# Altium project motordriver-v5.1.PrjPcb (part 1 of 3)
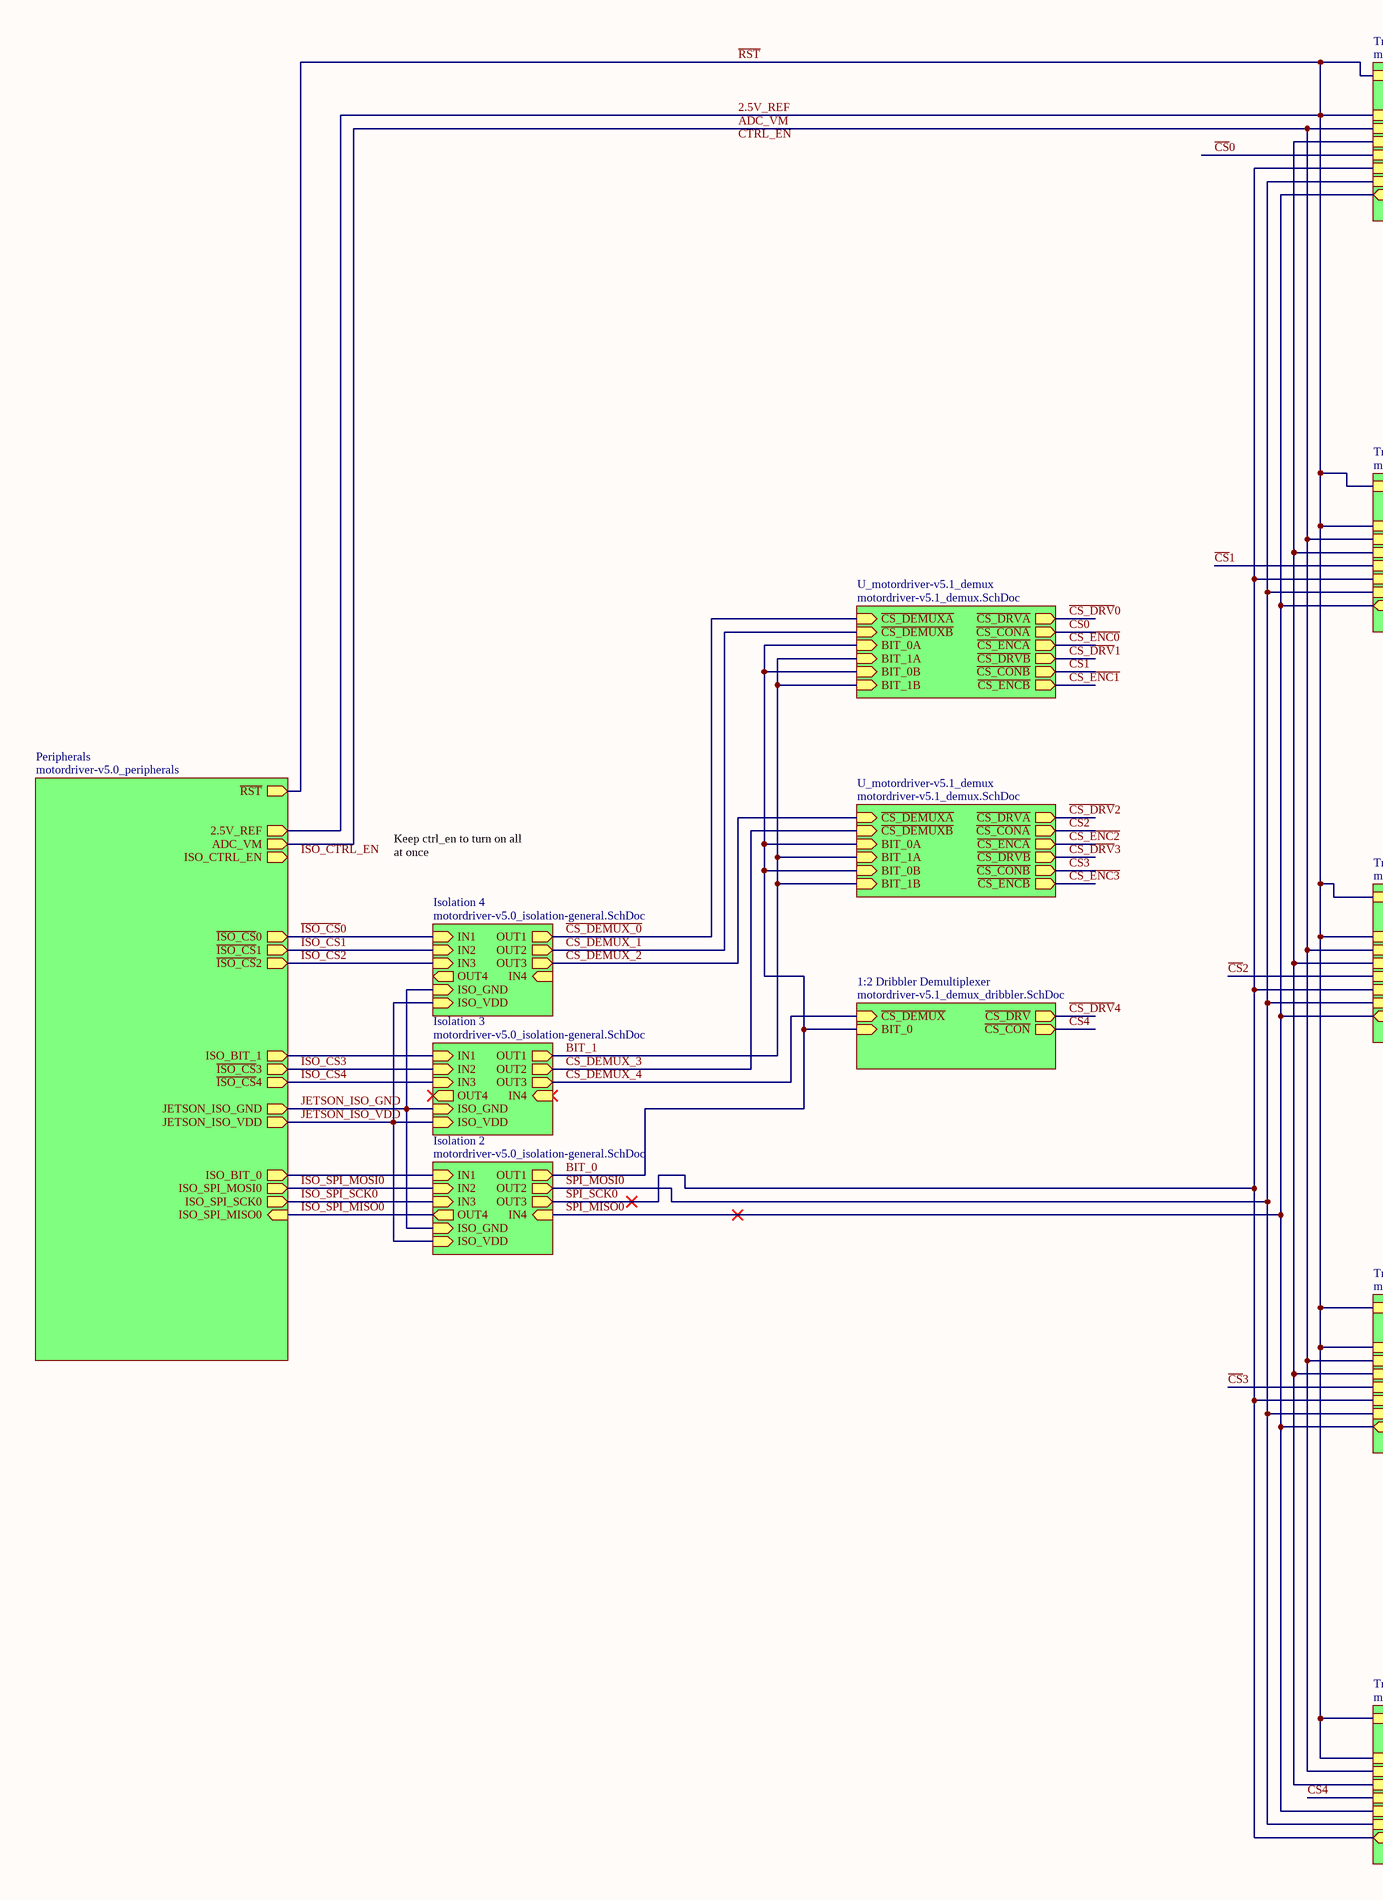
[diagram p0: motordriver-v5.0_top-level.SchDoc, left]
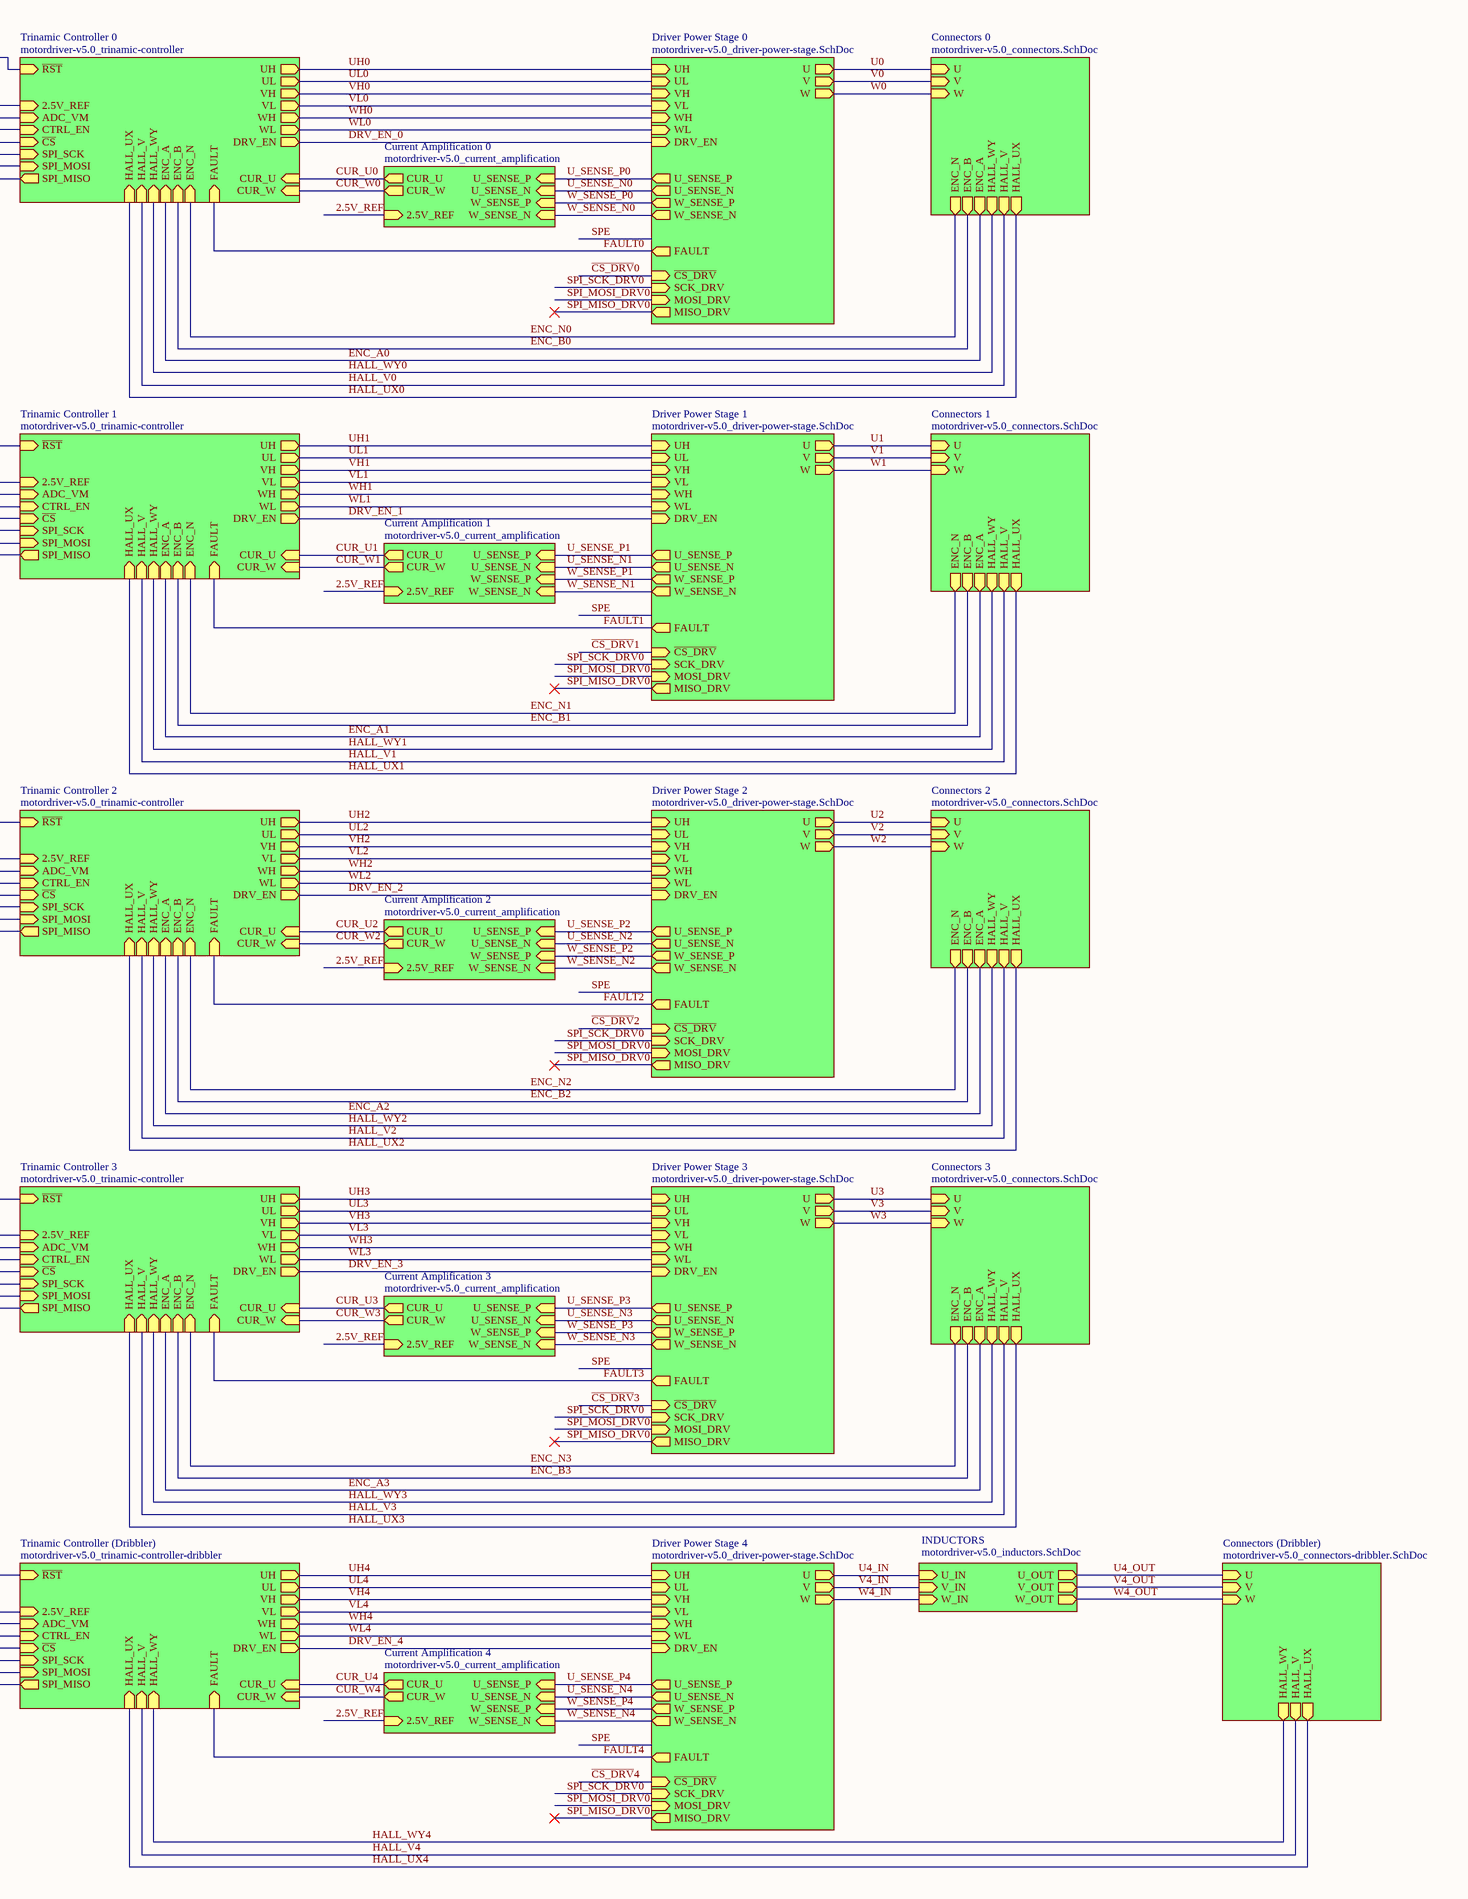
[diagram p1: motordriver-v5.0_top-level.SchDoc, right]
13 sheets, 758 parts. Net scope: hierarchical (ports join the sheet entries above them; power ports are global).
Board file: motordriver-v5.0.PcbDoc
Sheets:
  motordriver-v5.0_top-level.SchDoc
    Peripherals = motordriver-v5.0_peripherals.SchDoc
    INDUCTORS = motordriver-v5.0_inductors.SchDoc
    Trinamic Controller (Dribbler) = motordriver-v5.0_trinamic-controller-dribbler.SchDoc
    Connectors (Dribbler) = motordriver-v5.0_connectors-dribbler.SchDoc
    Driver Power Stage 0 = motordriver-v5.0_driver-power-stage.SchDoc
    Trinamic Controller 0 = motordriver-v5.0_trinamic-controller.SchDoc
    Connectors 0 = motordriver-v5.0_connectors.SchDoc
    Isolation 2 = motordriver-v5.0_isolation-general.SchDoc
    Current Amplification 0 = motordriver-v5.0_current_amplification.SchDoc
    Driver Power Stage 1 = motordriver-v5.0_driver-power-stage.SchDoc
    Trinamic Controller 1 = motordriver-v5.0_trinamic-controller.SchDoc
    Connectors 1 = motordriver-v5.0_connectors.SchDoc
    Current Amplification 1 = motordriver-v5.0_current_amplification.SchDoc
    Driver Power Stage 2 = motordriver-v5.0_driver-power-stage.SchDoc
    Trinamic Controller 2 = motordriver-v5.0_trinamic-controller.SchDoc
    Connectors 2 = motordriver-v5.0_connectors.SchDoc
    Current Amplification 2 = motordriver-v5.0_current_amplification.SchDoc
    Driver Power Stage 3 = motordriver-v5.0_driver-power-stage.SchDoc
    Trinamic Controller 3 = motordriver-v5.0_trinamic-controller.SchDoc
    Connectors 3 = motordriver-v5.0_connectors.SchDoc
    Current Amplification 3 = motordriver-v5.0_current_amplification.SchDoc
    Driver Power Stage 4 = motordriver-v5.0_driver-power-stage.SchDoc
    Current Amplification 4 = motordriver-v5.0_current_amplification.SchDoc
    1:2 Dribbler Demultiplexer = motordriver-v5.1_demux_dribbler.SchDoc
    U_motordriver-v5.1_demux = motordriver-v5.1_demux.SchDoc
    U_motordriver-v5.1_demux = motordriver-v5.1_demux.SchDoc
    Isolation 3 = motordriver-v5.0_isolation-general.SchDoc
    Isolation 4 = motordriver-v5.0_isolation-general.SchDoc
  top-level-simplified.SchDoc
    Peripherals = motordriver-v5.0_peripherals.SchDoc
    Driver Power Stage = motordriver-v5.0_driver-power-stage.SchDoc
    Trinamic Controller = motordriver-v5.0_trinamic-controller.SchDoc
    Connectors = motordriver-v5.0_connectors.SchDoc
    Current Amplification = motordriver-v5.0_current_amplification.SchDoc
    Isolation = motordriver-v5.0_isolation-general.SchDoc
    INDUCTORS = motordriver-v5.0_inductors.SchDoc

## Sheet motordriver-v5.0_top-level.SchDoc
size 863 x 558 mm; SheetNumber: 1; SheetTotal: 12

### Sub-sheets
1:2 Dribbler Demultiplexer = motordriver-v5.1_demux_dribbler.SchDoc: ~{CS_DRV} (out), ~{CS_CON} (out), ~{CS_DEMUX} (in), BIT_0 (in)
Connectors 0 = motordriver-v5.0_connectors.SchDoc: U (in), V (in), W (in), HALL_UX (out), HALL_V (out), HALL_WY (out), ENC_A (out), ENC_B (out), ENC_N (out)
Connectors 1 = motordriver-v5.0_connectors.SchDoc: U (in), V (in), W (in), HALL_UX (out), HALL_V (out), HALL_WY (out), ENC_A (out), ENC_B (out), ENC_N (out)
Connectors 2 = motordriver-v5.0_connectors.SchDoc: U (in), V (in), W (in), HALL_UX (out), HALL_V (out), HALL_WY (out), ENC_A (out), ENC_B (out), ENC_N (out)
Connectors 3 = motordriver-v5.0_connectors.SchDoc: U (in), V (in), W (in), HALL_UX (out), HALL_V (out), HALL_WY (out), ENC_A (out), ENC_B (out), ENC_N (out)
Connectors (Dribbler) = motordriver-v5.0_connectors-dribbler.SchDoc: U (in), V (in), W (in), HALL_UX (out), HALL_V (out), HALL_WY (out)
Current Amplification 0 = motordriver-v5.0_current_amplification: CUR_U (out), CUR_W (out), U_SENSE_P (in), U_SENSE_N (in), W_SENSE_N (in), W_SENSE_P (in), 2.5V_REF (in)
Current Amplification 1 = motordriver-v5.0_current_amplification: CUR_U (out), CUR_W (out), U_SENSE_P (in), U_SENSE_N (in), W_SENSE_N (in), W_SENSE_P (in), 2.5V_REF (in)
Current Amplification 2 = motordriver-v5.0_current_amplification: CUR_U (out), CUR_W (out), U_SENSE_P (in), U_SENSE_N (in), W_SENSE_N (in), W_SENSE_P (in), 2.5V_REF (in)
Current Amplification 3 = motordriver-v5.0_current_amplification: CUR_U (out), CUR_W (out), U_SENSE_P (in), U_SENSE_N (in), W_SENSE_N (in), W_SENSE_P (in), 2.5V_REF (in)
Current Amplification 4 = motordriver-v5.0_current_amplification: CUR_U (out), CUR_W (out), U_SENSE_P (in), U_SENSE_N (in), W_SENSE_N (in), W_SENSE_P (in), 2.5V_REF (in)
Driver Power Stage 0 = motordriver-v5.0_driver-power-stage.SchDoc: U (out), V (out), W (out), U_SENSE_P (out), U_SENSE_N (out), DRV_EN (in), UH (in), UL (in), VH (in), VL (in), WH (in), WL (in), FAULT (out), ~{CS_DRV} (in), MISO_DRV (out), MOSI_DRV (in), SCK_DRV (in), W_SENSE_P (out), W_SENSE_N (out)
Driver Power Stage 1 = motordriver-v5.0_driver-power-stage.SchDoc: U (out), V (out), W (out), U_SENSE_P (out), U_SENSE_N (out), DRV_EN (in), UH (in), UL (in), VH (in), VL (in), WH (in), WL (in), FAULT (out), ~{CS_DRV} (in), MISO_DRV (out), MOSI_DRV (in), SCK_DRV (in), W_SENSE_P (out), W_SENSE_N (out)
Driver Power Stage 2 = motordriver-v5.0_driver-power-stage.SchDoc: U (out), V (out), W (out), U_SENSE_P (out), U_SENSE_N (out), DRV_EN (in), UH (in), UL (in), VH (in), VL (in), WH (in), WL (in), FAULT (out), ~{CS_DRV} (in), MISO_DRV (out), MOSI_DRV (in), SCK_DRV (in), W_SENSE_P (out), W_SENSE_N (out)
Driver Power Stage 3 = motordriver-v5.0_driver-power-stage.SchDoc: U (out), V (out), W (out), U_SENSE_P (out), U_SENSE_N (out), DRV_EN (in), UH (in), UL (in), VH (in), VL (in), WH (in), WL (in), FAULT (out), ~{CS_DRV} (in), MISO_DRV (out), MOSI_DRV (in), SCK_DRV (in), W_SENSE_P (out), W_SENSE_N (out)
Driver Power Stage 4 = motordriver-v5.0_driver-power-stage.SchDoc: U (out), V (out), W (out), U_SENSE_P (out), U_SENSE_N (out), DRV_EN (in), UH (in), UL (in), VH (in), VL (in), WH (in), WL (in), FAULT (out), ~{CS_DRV} (in), MISO_DRV (out), MOSI_DRV (in), SCK_DRV (in), W_SENSE_P (out), W_SENSE_N (out)
INDUCTORS = motordriver-v5.0_inductors.SchDoc: U_IN (in), V_IN (in), W_IN (in), V_OUT (out), W_OUT (out), U_OUT (out)
Isolation 2 = motordriver-v5.0_isolation-general.SchDoc: OUT1 (out), IN1 (in), IN2 (in), IN3 (in), OUT4 (out), IN4 (in), OUT3 (out), OUT2 (out), ISO_GND (in), ISO_VDD (in)
Isolation 3 = motordriver-v5.0_isolation-general.SchDoc: OUT1 (out), IN1 (in), IN2 (in), IN3 (in), OUT4 (out), IN4 (in), OUT3 (out), OUT2 (out), ISO_GND (in), ISO_VDD (in)
Isolation 4 = motordriver-v5.0_isolation-general.SchDoc: OUT1 (out), IN1 (in), IN2 (in), IN3 (in), OUT4 (out), IN4 (in), OUT3 (out), OUT2 (out), ISO_GND (in), ISO_VDD (in)
Peripherals = motordriver-v5.0_peripherals: ~{RST} (out), ADC_VM (out), ISO_CTRL_EN (out), ISO_SPI_MISO0 (in), JETSON_ISO_VDD (out), JETSON_ISO_GND (out), ~{ISO_CS}1 (out), ~{ISO_CS}2 (out), ~{ISO_CS}4 (out), 2.5V_REF (out), ~{ISO_CS}0 (out), ISO_BIT_1 (out), ~{ISO_CS}3 (out), ISO_SPI_MOSI0 (out), ISO_SPI_SCK0 (out), ISO_BIT_0 (out)
Trinamic Controller 0 = motordriver-v5.0_trinamic-controller: ~{RST} (in), CUR_U (in), CUR_W (in), DRV_EN (out), ADC_VM (in), CTRL_EN (in), UH (out), UL (out), VH (out), VL (out), WH (out), WL (out), HALL_UX (in), HALL_V (in), HALL_WY (in), ENC_A (in), ENC_B (in), ENC_N (in), ~{CS} (in), SPI_MISO (out), SPI_MOSI (in), SPI_SCK (in), 2.5V_REF (in), FAULT (in)
Trinamic Controller 1 = motordriver-v5.0_trinamic-controller: ~{RST} (in), CUR_U (in), CUR_W (in), DRV_EN (out), ADC_VM (in), CTRL_EN (in), UH (out), UL (out), VH (out), VL (out), WH (out), WL (out), HALL_UX (in), HALL_V (in), HALL_WY (in), ENC_A (in), ENC_B (in), ENC_N (in), ~{CS} (in), SPI_MISO (out), SPI_MOSI (in), SPI_SCK (in), 2.5V_REF (in), FAULT (in)
Trinamic Controller 2 = motordriver-v5.0_trinamic-controller: ~{RST} (in), CUR_U (in), CUR_W (in), DRV_EN (out), ADC_VM (in), CTRL_EN (in), UH (out), UL (out), VH (out), VL (out), WH (out), WL (out), HALL_UX (in), HALL_V (in), HALL_WY (in), ENC_A (in), ENC_B (in), ENC_N (in), ~{CS} (in), SPI_MISO (out), SPI_MOSI (in), SPI_SCK (in), 2.5V_REF (in), FAULT (in)
Trinamic Controller 3 = motordriver-v5.0_trinamic-controller: ~{RST} (in), CUR_U (in), CUR_W (in), DRV_EN (out), ADC_VM (in), CTRL_EN (in), UH (out), UL (out), VH (out), VL (out), WH (out), WL (out), HALL_UX (in), HALL_V (in), HALL_WY (in), ENC_A (in), ENC_B (in), ENC_N (in), ~{CS} (in), SPI_MISO (out), SPI_MOSI (in), SPI_SCK (in), 2.5V_REF (in), FAULT (in)
Trinamic Controller (Dribbler) = motordriver-v5.0_trinamic-controller-dribbler: ~{RST} (in), CUR_U (in), CUR_W (in), DRV_EN (out), UH (out), UL (out), VH (out), VL (out), WH (out), WL (out), HALL_UX (in), HALL_V (in), HALL_WY (in), ADC_VM (in), CTRL_EN (in), ~{CS} (in), SPI_MISO (out), SPI_MOSI (in), SPI_SCK (in), 2.5V_REF (in), FAULT (in)
U_motordriver-v5.1_demux = motordriver-v5.1_demux.SchDoc: ~{CS_DEMUXA} (in), ~{CS_DRVA} (out), ~{CS_CONA} (out), ~{CS_ENCA} (out), ~{CS_DEMUXB} (in), ~{CS_DRVB} (out), ~{CS_CONB} (out), ~{CS_ENCB} (out), BIT_0A (in), BIT_1A (in), BIT_0B (in), BIT_1B (in)
U_motordriver-v5.1_demux = motordriver-v5.1_demux.SchDoc: ~{CS_DEMUXA} (in), ~{CS_DRVA} (out), ~{CS_CONA} (out), ~{CS_ENCA} (out), ~{CS_DEMUXB} (in), ~{CS_DRVB} (out), ~{CS_CONB} (out), ~{CS_ENCB} (out), BIT_0A (in), BIT_1A (in), BIT_0B (in), BIT_1B (in)

### Nets
2.5V_REF: sheet Peripherals/~{RST}, sheet Peripherals/2.5V_REF, sheet Trinamic Controller (Dribbler)/~{RST}, sheet Trinamic Controller (Dribbler)/2.5V_REF, sheet Trinamic Controller 0/~{RST}, sheet Trinamic Controller 0/2.5V_REF, sheet Current Amplification 0/2.5V_REF, sheet Trinamic Controller 1/~{RST}, sheet Trinamic Controller 1/2.5V_REF, sheet Current Amplification 1/2.5V_REF, sheet Trinamic Controller 2/~{RST}, sheet Trinamic Controller 2/2.5V_REF, sheet Current Amplification 2/2.5V_REF, sheet Trinamic Controller 3/~{RST}, sheet Trinamic Controller 3/2.5V_REF, sheet Current Amplification 3/2.5V_REF, sheet Current Amplification 4/2.5V_REF  [also labelled ~{RST}]
ADC_VM: sheet Peripherals/ADC_VM, sheet Trinamic Controller (Dribbler)/ADC_VM, sheet Trinamic Controller 0/ADC_VM, sheet Trinamic Controller 1/ADC_VM, sheet Trinamic Controller 2/ADC_VM, sheet Trinamic Controller 3/ADC_VM
BIT_0: sheet Isolation 2/OUT1, sheet 1:2 Dribbler Demultiplexer/BIT_0, sheet U_motordriver-v5.1_demux/BIT_0A, sheet U_motordriver-v5.1_demux/BIT_0B, sheet U_motordriver-v5.1_demux/BIT_0A, sheet U_motordriver-v5.1_demux/BIT_0B
BIT_1: sheet U_motordriver-v5.1_demux/BIT_1A, sheet U_motordriver-v5.1_demux/BIT_1B, sheet U_motordriver-v5.1_demux/BIT_1A, sheet U_motordriver-v5.1_demux/BIT_1B, sheet Isolation 3/OUT1
~{CS}0: sheet Trinamic Controller 0/~{CS}, sheet U_motordriver-v5.1_demux/~{CS_CONA}
~{CS}1: sheet Trinamic Controller 1/~{CS}, sheet U_motordriver-v5.1_demux/~{CS_CONB}
~{CS}2: sheet Trinamic Controller 2/~{CS}, sheet U_motordriver-v5.1_demux/~{CS_CONA}
~{CS}3: sheet Trinamic Controller 3/~{CS}, sheet U_motordriver-v5.1_demux/~{CS_CONB}
~{CS}4: sheet Trinamic Controller (Dribbler)/~{CS}, sheet 1:2 Dribbler Demultiplexer/~{CS_CON}
~{CS_DEMUX_0}: sheet U_motordriver-v5.1_demux/~{CS_DEMUXA}, sheet Isolation 4/OUT1
~{CS_DEMUX_1}: sheet U_motordriver-v5.1_demux/~{CS_DEMUXB}, sheet Isolation 4/OUT2
~{CS_DEMUX_2}: sheet U_motordriver-v5.1_demux/~{CS_DEMUXA}, sheet Isolation 4/OUT3
~{CS_DEMUX_3}: sheet U_motordriver-v5.1_demux/~{CS_DEMUXB}, sheet Isolation 3/OUT2
~{CS_DEMUX_4}: sheet 1:2 Dribbler Demultiplexer/~{CS_DEMUX}, sheet Isolation 3/OUT3
~{CS_DRV}0: sheet Driver Power Stage 0/~{CS_DRV}, sheet U_motordriver-v5.1_demux/~{CS_DRVA}
~{CS_DRV}1: sheet Driver Power Stage 1/~{CS_DRV}, sheet U_motordriver-v5.1_demux/~{CS_DRVB}
~{CS_DRV}2: sheet Driver Power Stage 2/~{CS_DRV}, sheet U_motordriver-v5.1_demux/~{CS_DRVA}
~{CS_DRV}3: sheet Driver Power Stage 3/~{CS_DRV}, sheet U_motordriver-v5.1_demux/~{CS_DRVB}
~{CS_DRV}4: sheet Driver Power Stage 4/~{CS_DRV}, sheet 1:2 Dribbler Demultiplexer/~{CS_DRV}
CTRL_EN: sheet Trinamic Controller (Dribbler)/CTRL_EN, sheet Trinamic Controller 0/CTRL_EN, sheet Trinamic Controller 1/CTRL_EN, sheet Trinamic Controller 2/CTRL_EN, sheet Trinamic Controller 3/CTRL_EN
CUR_U0: sheet Trinamic Controller 0/CUR_U, sheet Current Amplification 0/CUR_U
CUR_U1: sheet Trinamic Controller 1/CUR_U, sheet Current Amplification 1/CUR_U
CUR_U2: sheet Trinamic Controller 2/CUR_U, sheet Current Amplification 2/CUR_U
CUR_U3: sheet Trinamic Controller 3/CUR_U, sheet Current Amplification 3/CUR_U
CUR_U4: sheet Trinamic Controller (Dribbler)/CUR_U, sheet Current Amplification 4/CUR_U
CUR_W0: sheet Trinamic Controller 0/CUR_W, sheet Current Amplification 0/CUR_W
CUR_W1: sheet Trinamic Controller 1/CUR_W, sheet Current Amplification 1/CUR_W
CUR_W2: sheet Trinamic Controller 2/CUR_W, sheet Current Amplification 2/CUR_W
CUR_W3: sheet Trinamic Controller 3/CUR_W, sheet Current Amplification 3/CUR_W
CUR_W4: sheet Trinamic Controller (Dribbler)/CUR_W, sheet Current Amplification 4/CUR_W
DRV_EN_0: sheet Driver Power Stage 0/DRV_EN, sheet Trinamic Controller 0/DRV_EN
DRV_EN_1: sheet Driver Power Stage 1/DRV_EN, sheet Trinamic Controller 1/DRV_EN
DRV_EN_2: sheet Driver Power Stage 2/DRV_EN, sheet Trinamic Controller 2/DRV_EN
DRV_EN_3: sheet Driver Power Stage 3/DRV_EN, sheet Trinamic Controller 3/DRV_EN
DRV_EN_4: sheet Trinamic Controller (Dribbler)/DRV_EN, sheet Driver Power Stage 4/DRV_EN
ENC_A0: sheet Trinamic Controller 0/ENC_A, sheet Connectors 0/ENC_A
ENC_A1: sheet Trinamic Controller 1/ENC_A, sheet Connectors 1/ENC_A
ENC_A2: sheet Trinamic Controller 2/ENC_A, sheet Connectors 2/ENC_A
ENC_A3: sheet Trinamic Controller 3/ENC_A, sheet Connectors 3/ENC_A
ENC_B0: sheet Trinamic Controller 0/ENC_B, sheet Connectors 0/ENC_B
ENC_B1: sheet Trinamic Controller 1/ENC_B, sheet Connectors 1/ENC_B
ENC_B2: sheet Trinamic Controller 2/ENC_B, sheet Connectors 2/ENC_B
ENC_B3: sheet Trinamic Controller 3/ENC_B, sheet Connectors 3/ENC_B
ENC_N0: sheet Trinamic Controller 0/ENC_N, sheet Connectors 0/ENC_N
ENC_N1: sheet Trinamic Controller 1/ENC_N, sheet Connectors 1/ENC_N
ENC_N2: sheet Trinamic Controller 2/ENC_N, sheet Connectors 2/ENC_N
ENC_N3: sheet Trinamic Controller 3/ENC_N, sheet Connectors 3/ENC_N
FAULT0: sheet Driver Power Stage 0/FAULT, sheet Trinamic Controller 0/FAULT
FAULT1: sheet Driver Power Stage 1/FAULT, sheet Trinamic Controller 1/FAULT
FAULT2: sheet Driver Power Stage 2/FAULT, sheet Trinamic Controller 2/FAULT
FAULT3: sheet Driver Power Stage 3/FAULT, sheet Trinamic Controller 3/FAULT
FAULT4: sheet Trinamic Controller (Dribbler)/FAULT, sheet Driver Power Stage 4/FAULT
HALL_UX0: sheet Trinamic Controller 0/HALL_UX, sheet Connectors 0/HALL_UX
HALL_UX1: sheet Trinamic Controller 1/HALL_UX, sheet Connectors 1/HALL_UX
HALL_UX2: sheet Trinamic Controller 2/HALL_UX, sheet Connectors 2/HALL_UX
HALL_UX3: sheet Trinamic Controller 3/HALL_UX, sheet Connectors 3/HALL_UX
HALL_UX4: sheet Trinamic Controller (Dribbler)/HALL_UX, sheet Connectors (Dribbler)/HALL_UX
HALL_V0: sheet Trinamic Controller 0/HALL_V, sheet Connectors 0/HALL_V
HALL_V1: sheet Trinamic Controller 1/HALL_V, sheet Connectors 1/HALL_V
HALL_V2: sheet Trinamic Controller 2/HALL_V, sheet Connectors 2/HALL_V
HALL_V3: sheet Trinamic Controller 3/HALL_V, sheet Connectors 3/HALL_V
HALL_V4: sheet Trinamic Controller (Dribbler)/HALL_V, sheet Connectors (Dribbler)/HALL_V
HALL_WY0: sheet Trinamic Controller 0/HALL_WY, sheet Connectors 0/HALL_WY
HALL_WY1: sheet Trinamic Controller 1/HALL_WY, sheet Connectors 1/HALL_WY
HALL_WY2: sheet Trinamic Controller 2/HALL_WY, sheet Connectors 2/HALL_WY
HALL_WY3: sheet Trinamic Controller 3/HALL_WY, sheet Connectors 3/HALL_WY
HALL_WY4: sheet Trinamic Controller (Dribbler)/HALL_WY, sheet Connectors (Dribbler)/HALL_WY
~{ISO_CS}0: sheet Peripherals/~{ISO_CS}0, sheet Isolation 4/IN1
~{ISO_CS}1: sheet Peripherals/~{ISO_CS}1, sheet Isolation 4/IN2
~{ISO_CS}2: sheet Peripherals/~{ISO_CS}2, sheet Isolation 4/IN3
~{ISO_CS}3: sheet Peripherals/~{ISO_CS}3, sheet Isolation 3/IN2
~{ISO_CS}4: sheet Peripherals/~{ISO_CS}4, sheet Isolation 3/IN3
IN1: sheet Peripherals/ISO_BIT_0, sheet Isolation 2/IN1
IN1: sheet Peripherals/ISO_BIT_1, sheet Isolation 3/IN1  [a separate net that carries the same name]
ISO_SPI_MISO0: sheet Peripherals/ISO_SPI_MISO0, sheet Isolation 2/OUT4
ISO_SPI_MOSI0: sheet Peripherals/ISO_SPI_MOSI0, sheet Isolation 2/IN2
ISO_SPI_SCK0: sheet Peripherals/ISO_SPI_SCK0, sheet Isolation 2/IN3
JETSON_ISO_GND: sheet Peripherals/JETSON_ISO_GND, sheet Isolation 2/ISO_GND, sheet Isolation 3/ISO_GND, sheet Isolation 4/ISO_GND
JETSON_ISO_VDD: sheet Peripherals/JETSON_ISO_VDD, sheet Isolation 2/ISO_VDD, sheet Isolation 3/ISO_VDD, sheet Isolation 4/ISO_VDD
SPI_MISO0: sheet Trinamic Controller (Dribbler)/SPI_SCK, sheet Trinamic Controller 0/SPI_MISO, sheet Isolation 2/IN4, sheet Trinamic Controller 1/SPI_MISO, sheet Trinamic Controller 2/SPI_MISO, sheet Trinamic Controller 3/SPI_MISO
SPI_MISO_DRV0: sheet Driver Power Stage 0/MISO_DRV, sheet Driver Power Stage 1/MISO_DRV, sheet Driver Power Stage 2/MISO_DRV, sheet Driver Power Stage 3/MISO_DRV, sheet Driver Power Stage 4/MISO_DRV
SPI_MOSI0: sheet Trinamic Controller (Dribbler)/SPI_MOSI, sheet Trinamic Controller 0/SPI_MOSI, sheet Isolation 2/OUT2, sheet Trinamic Controller 1/SPI_MOSI, sheet Trinamic Controller 2/SPI_MOSI, sheet Trinamic Controller 3/SPI_MOSI
SPI_MOSI_DRV0: sheet Driver Power Stage 0/MOSI_DRV, sheet Driver Power Stage 1/MOSI_DRV, sheet Driver Power Stage 2/MOSI_DRV, sheet Driver Power Stage 3/MOSI_DRV, sheet Driver Power Stage 4/MOSI_DRV
SPI_SCK0: sheet Trinamic Controller (Dribbler)/SPI_MISO, sheet Trinamic Controller 0/SPI_SCK, sheet Isolation 2/OUT3, sheet Trinamic Controller 1/SPI_SCK, sheet Trinamic Controller 2/SPI_SCK, sheet Trinamic Controller 3/SPI_SCK
SPI_SCK_DRV0: sheet Driver Power Stage 0/SCK_DRV, sheet Driver Power Stage 1/SCK_DRV, sheet Driver Power Stage 2/SCK_DRV, sheet Driver Power Stage 3/SCK_DRV, sheet Driver Power Stage 4/SCK_DRV
U0: sheet Driver Power Stage 0/U, sheet Driver Power Stage 0/U_SENSE_N, sheet Connectors 0/U, sheet Current Amplification 0/U_SENSE_N  [also labelled U_SENSE_N0]
U1: sheet Driver Power Stage 1/U, sheet Driver Power Stage 1/U_SENSE_N, sheet Connectors 1/U, sheet Current Amplification 1/U_SENSE_N  [also labelled U_SENSE_N1]
U2: sheet Driver Power Stage 2/U, sheet Driver Power Stage 2/U_SENSE_N, sheet Connectors 2/U, sheet Current Amplification 2/U_SENSE_N  [also labelled U_SENSE_N2]
U3: sheet Driver Power Stage 3/U, sheet Driver Power Stage 3/U_SENSE_N, sheet Connectors 3/U, sheet Current Amplification 3/U_SENSE_N  [also labelled U_SENSE_N3]
U4_IN: sheet INDUCTORS/U_IN, sheet Driver Power Stage 4/U, sheet Driver Power Stage 4/U_SENSE_N, sheet Current Amplification 4/U_SENSE_N  [also labelled U_SENSE_N4]
U4_OUT: sheet INDUCTORS/U_OUT, sheet Connectors (Dribbler)/U
U_SENSE_P0: sheet Driver Power Stage 0/U_SENSE_P, sheet Current Amplification 0/U_SENSE_P  [project net U]
U_SENSE_P1: sheet Driver Power Stage 1/U_SENSE_P, sheet Current Amplification 1/U_SENSE_P  [project net U]
U_SENSE_P2: sheet Driver Power Stage 2/U_SENSE_P, sheet Current Amplification 2/U_SENSE_P  [project net U]
U_SENSE_P3: sheet Driver Power Stage 3/U_SENSE_P, sheet Current Amplification 3/U_SENSE_P  [project net U]
U_SENSE_P4: sheet Driver Power Stage 4/U_SENSE_P, sheet Current Amplification 4/U_SENSE_P  [project net U]
UH0: sheet Driver Power Stage 0/UH, sheet Trinamic Controller 0/UH
UH1: sheet Driver Power Stage 1/UH, sheet Trinamic Controller 1/UH
UH2: sheet Driver Power Stage 2/UH, sheet Trinamic Controller 2/UH
UH3: sheet Driver Power Stage 3/UH, sheet Trinamic Controller 3/UH
UH4: sheet Trinamic Controller (Dribbler)/UH, sheet Driver Power Stage 4/UH
UL0: sheet Driver Power Stage 0/UL, sheet Trinamic Controller 0/UL
UL1: sheet Driver Power Stage 1/UL, sheet Trinamic Controller 1/UL
UL2: sheet Driver Power Stage 2/UL, sheet Trinamic Controller 2/UL
UL3: sheet Driver Power Stage 3/UL, sheet Trinamic Controller 3/UL
UL4: sheet Trinamic Controller (Dribbler)/UL, sheet Driver Power Stage 4/UL
V0: sheet Driver Power Stage 0/V, sheet Connectors 0/V
V1: sheet Driver Power Stage 1/V, sheet Connectors 1/V
V2: sheet Driver Power Stage 2/V, sheet Connectors 2/V
V3: sheet Driver Power Stage 3/V, sheet Connectors 3/V
V4_IN: sheet INDUCTORS/V_IN, sheet Driver Power Stage 4/V
V4_OUT: sheet INDUCTORS/V_OUT, sheet Connectors (Dribbler)/V
VH0: sheet Driver Power Stage 0/VH, sheet Trinamic Controller 0/VH
VH1: sheet Driver Power Stage 1/VH, sheet Trinamic Controller 1/VH
VH2: sheet Driver Power Stage 2/VH, sheet Trinamic Controller 2/VH
VH3: sheet Driver Power Stage 3/VH, sheet Trinamic Controller 3/VH
VH4: sheet Trinamic Controller (Dribbler)/VH, sheet Driver Power Stage 4/VH
VL0: sheet Driver Power Stage 0/VL, sheet Trinamic Controller 0/VL
VL1: sheet Driver Power Stage 1/VL, sheet Trinamic Controller 1/VL
VL2: sheet Driver Power Stage 2/VL, sheet Trinamic Controller 2/VL
VL3: sheet Driver Power Stage 3/VL, sheet Trinamic Controller 3/VL
VL4: sheet Trinamic Controller (Dribbler)/VL, sheet Driver Power Stage 4/VL
W0: sheet Driver Power Stage 0/W, sheet Driver Power Stage 0/W_SENSE_N, sheet Connectors 0/W, sheet Current Amplification 0/W_SENSE_N  [also labelled W_SENSE_N0]
W1: sheet Driver Power Stage 1/W, sheet Driver Power Stage 1/W_SENSE_N, sheet Connectors 1/W, sheet Current Amplification 1/W_SENSE_N  [also labelled W_SENSE_N1]
W2: sheet Driver Power Stage 2/W, sheet Driver Power Stage 2/W_SENSE_N, sheet Connectors 2/W, sheet Current Amplification 2/W_SENSE_N  [also labelled W_SENSE_N2]
W3: sheet Driver Power Stage 3/W, sheet Driver Power Stage 3/W_SENSE_N, sheet Connectors 3/W, sheet Current Amplification 3/W_SENSE_N  [also labelled W_SENSE_N3]
W4_IN: sheet INDUCTORS/W_IN, sheet Driver Power Stage 4/W, sheet Driver Power Stage 4/W_SENSE_N, sheet Current Amplification 4/W_SENSE_N  [also labelled W_SENSE_N4]
W4_OUT: sheet INDUCTORS/W_OUT, sheet Connectors (Dribbler)/W
W_SENSE_P0: sheet Driver Power Stage 0/W_SENSE_P, sheet Current Amplification 0/W_SENSE_P  [project net W]
W_SENSE_P1: sheet Driver Power Stage 1/W_SENSE_P, sheet Current Amplification 1/W_SENSE_P  [project net W]
W_SENSE_P2: sheet Driver Power Stage 2/W_SENSE_P, sheet Current Amplification 2/W_SENSE_P  [project net W]
W_SENSE_P3: sheet Driver Power Stage 3/W_SENSE_P, sheet Current Amplification 3/W_SENSE_P  [project net W]
W_SENSE_P4: sheet Driver Power Stage 4/W_SENSE_P, sheet Current Amplification 4/W_SENSE_P  [project net W]
WH0: sheet Driver Power Stage 0/WH, sheet Trinamic Controller 0/WH
WH1: sheet Driver Power Stage 1/WH, sheet Trinamic Controller 1/WH
WH2: sheet Driver Power Stage 2/WH, sheet Trinamic Controller 2/WH
WH3: sheet Driver Power Stage 3/WH, sheet Trinamic Controller 3/WH
WH4: sheet Trinamic Controller (Dribbler)/WH, sheet Driver Power Stage 4/WH
WL0: sheet Driver Power Stage 0/WL, sheet Trinamic Controller 0/WL
WL1: sheet Driver Power Stage 1/WL, sheet Trinamic Controller 1/WL
WL2: sheet Driver Power Stage 2/WL, sheet Trinamic Controller 2/WL
WL3: sheet Driver Power Stage 3/WL, sheet Trinamic Controller 3/WL
WL4: sheet Trinamic Controller (Dribbler)/WL, sheet Driver Power Stage 4/WL

### Notes on the sheet
- Keep ctrl_en to turn on all at once
- Labels drawn without touching a wire or pin: CTRL_EN, ISO_CTRL_EN
- DWG. NO.
- REV.
- SHT.
- REVISION
- DESCRIPTION
- DATE
- APPROVED
- THIS DOCUMENT AND THE DATA DISCLOSED HEREIN OR HEREWITH IS THE PROPERTY OF ALTIUM LIMITED AND MAY BE FREELY DISTRIBUTED IN WHOLE. NO RIGHTS ARE RESERVED OR EXPRESS OR IMPLIED WARANTEE GIVEN.
- ENG:
- DSN:
- APPROVALS
- PROJECT
- DOCUMENT REVISION:
- DESIGN ITEM:
- CHK:
- BOM:
- REFERENCE DOCUMENTS
- PROJECT REVISION:
- TITLE
- FAB DWG:
- PCB DWG:
- ASSY DWG:
- SCALE:
- SIZE
- D
- CAGE CODE
- FILE NAME
- DWG NO.
- SHEET
- OF
- REV

## Sheet motordriver-v5.0_peripherals.SchDoc
size 420 x 297 mm; SheetNumber: 2; SheetTotal: 13
Used 2 times, as channels Peripherals, Peripherals. Parts and nets are listed once, with the designators drawn on the sheet.
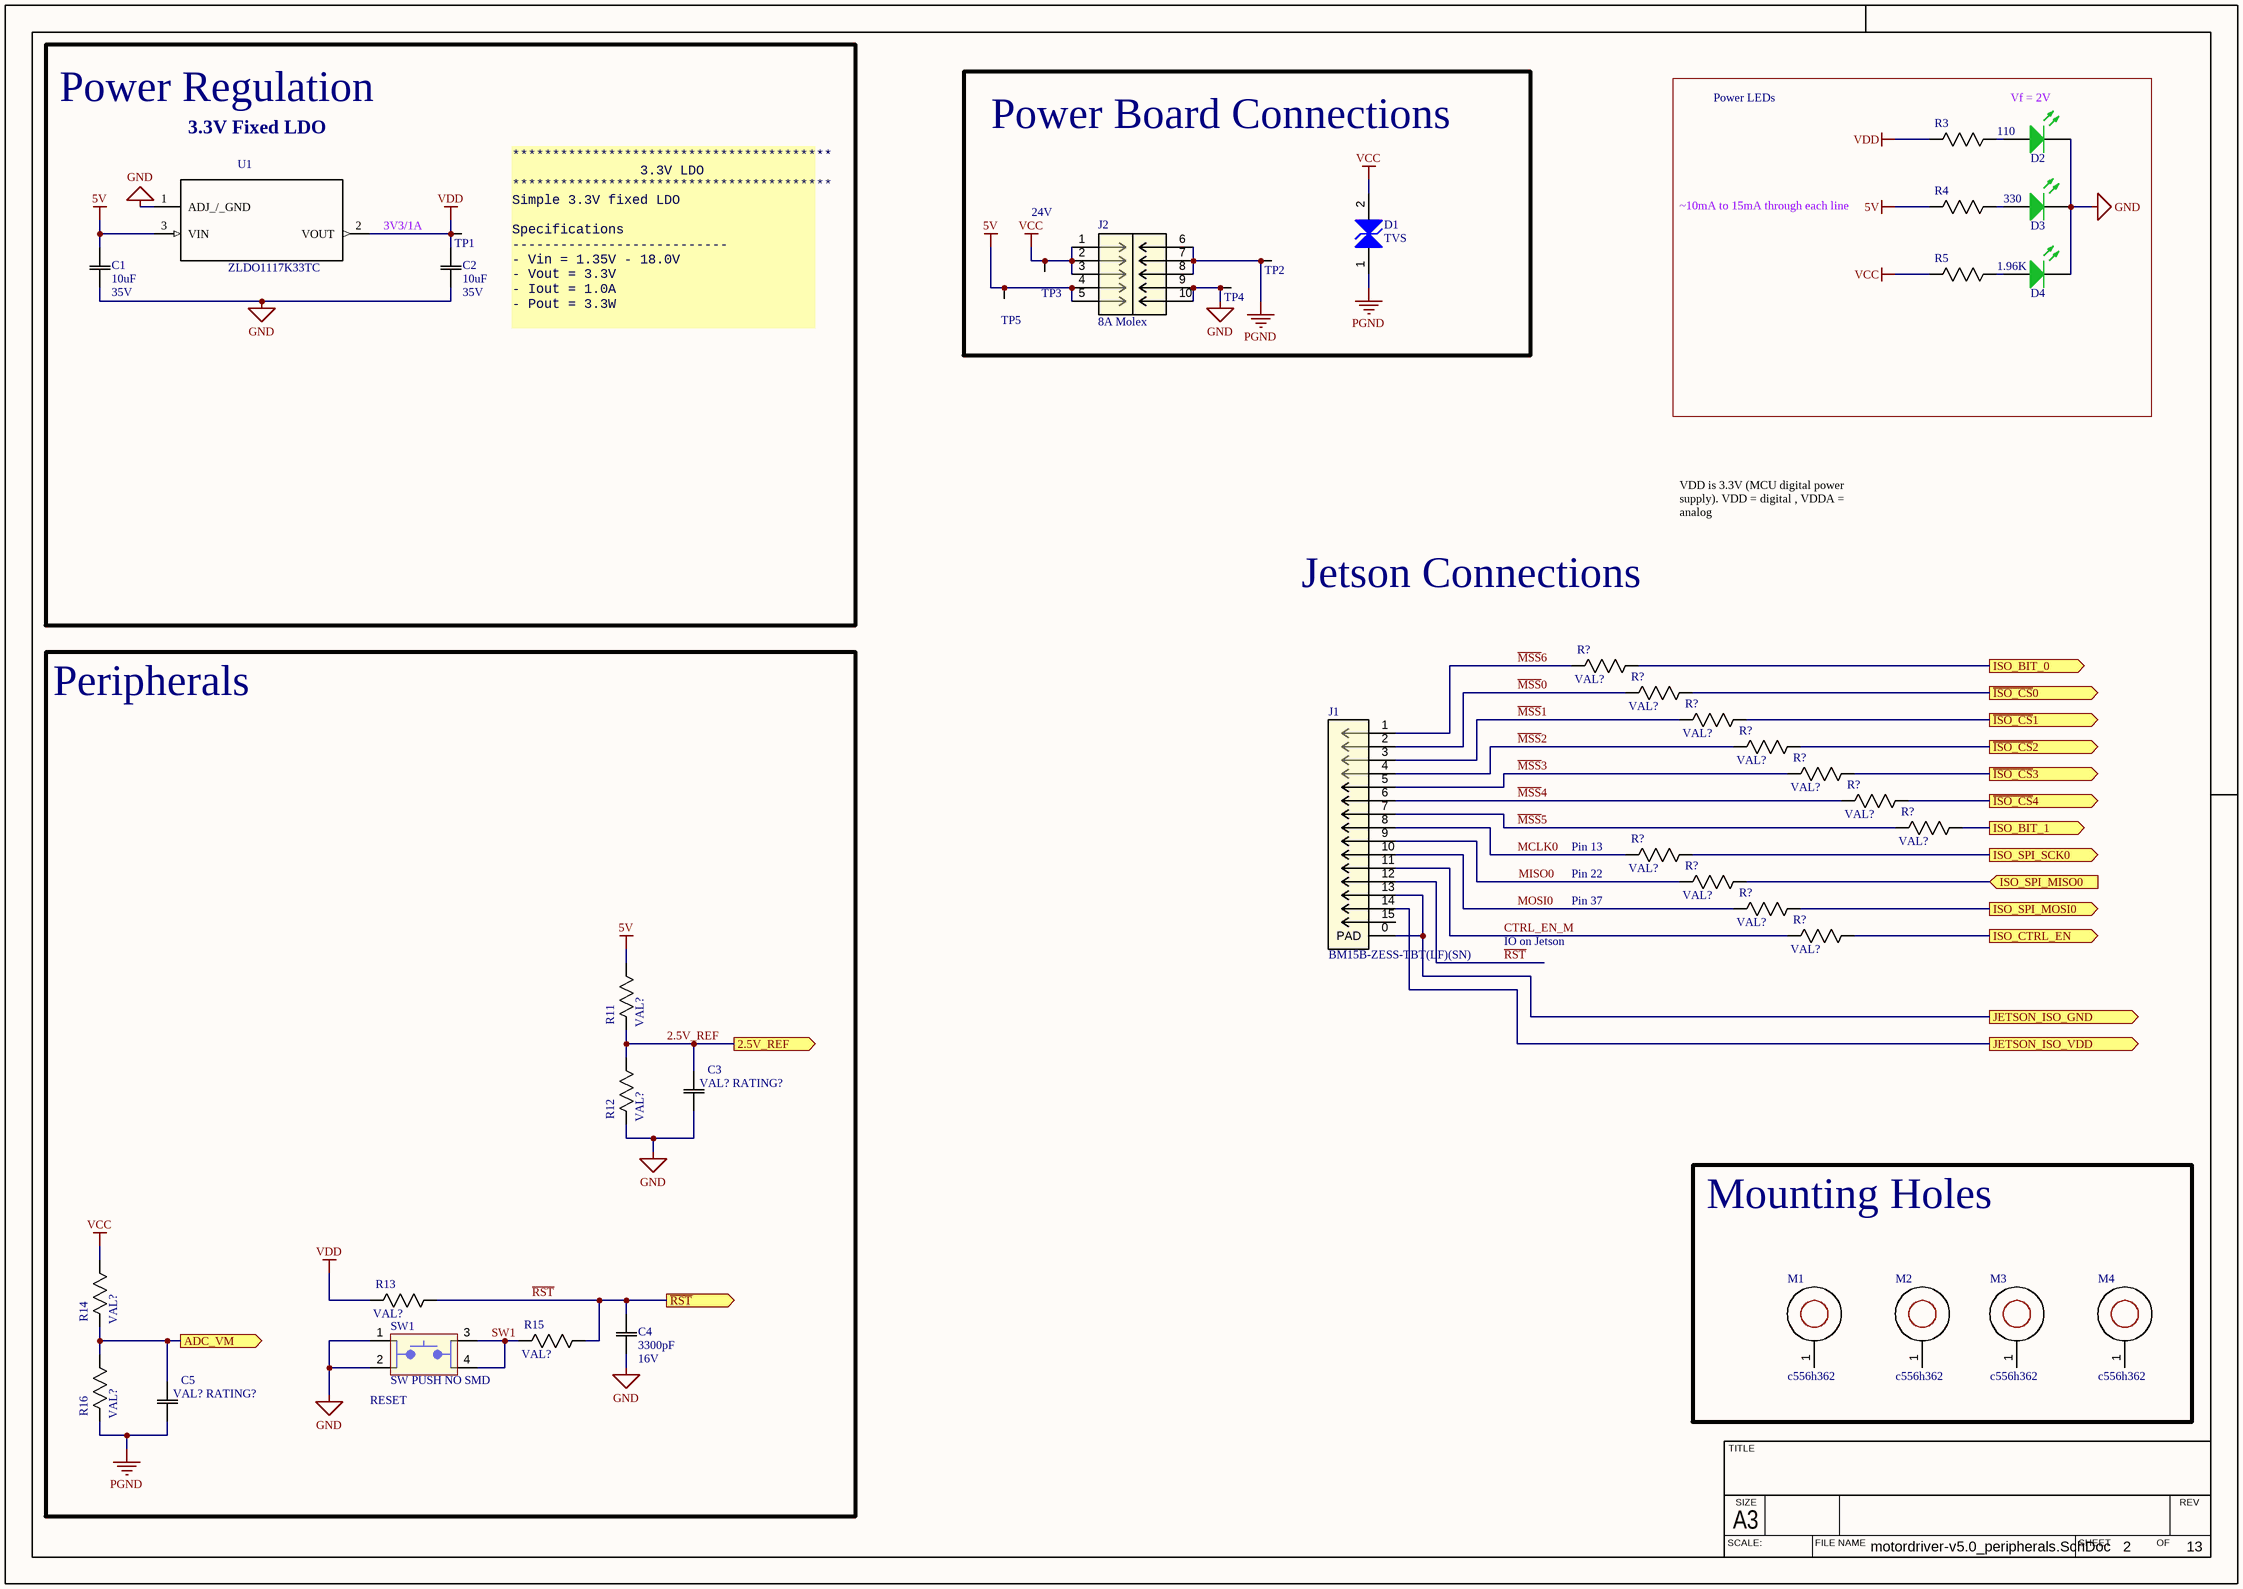
[diagram p2: motordriver-v5.0_peripherals.SchDoc]

### Parts
(Parts that share a designator on the sheet are numbered #1, #2 ... from top to bottom, then left to right.)
C1  value 10uF  Rating: 35V  [0805]  (hidden comment: VAL? RATING?)
C2  value 10uF  Rating: 35V  [0805]  (hidden comment: VAL? RATING?)
C3  VAL? RATING?  [0603]
C4  value 3300pF  Rating: 16V  [0603]  (hidden comment: VAL? RATING?)
C5  VAL? RATING?  [0603]
D1  TVS  [DO-214AC, SMA]
D2  LED2  [3.2X1.6X1.1]  (value not drawn)
D3  LED2  [3.2X1.6X1.1]  (value not drawn)
D4  LED2  [3.2X1.6X1.1]  (value not drawn)
J1  BM15B-ZESS-TBT(LF)(SN)  [JST ZE SMT 15POS]
J2  8A Molex  [MOLEX_0430451012]
M1  c556h362  [Mounting Hole c556h362]  (no BOM)
M2  c556h362  [Mounting Hole c556h362]  (no BOM)
M3  c556h362  [Mounting Hole c556h362]  (no BOM)
M4  c556h362  [Mounting Hole c556h362]  (no BOM)
R3  110  [0603]
R4  330  [0603]
R5  1.96K  [0603]
R11  VAL?  [0603]
R12  VAL?  [0603]
R13  VAL?  [0603]
R14  VAL?  [0603]
R15  VAL?  [0603]
R16  VAL?  [0603]
R?#1  VAL?  [0805]
R?#2  VAL?  [0805]
R?#3  VAL?  [0805]
R?#4  VAL?  [0805]
R?#5  VAL?  [0805]
R?#6  VAL?  [0805]
R?#7  VAL?  [0805]
R?#8  VAL?  [0805]
R?#9  VAL?  [0805]
R?#10  VAL?  [0805]
R?#11  VAL?  [0805]
SW1  SW PUSH NO SMD  [TL3305]
TP1  Test Point (Via)  [TP]  (value not drawn)
TP2  Test Point (Via)  [TP]  (value not drawn)
TP3  Test Point (Via)  [TP]  (value not drawn)
TP4  Test Point (Via)  [TP]  (value not drawn)
TP5  Test Point (Via)  [TP]  (value not drawn)
U1  ZLDO1117K33TC  [DPAK (TO-252)]

### Blocks framed on the sheet
Power Regulation: C1 C2 TP1 U1
Power Board Connections: D1 J2 TP2-TP5
Peripherals: C3-C5 R11-R16 SW1
Mounting Holes: M1-M4

### Ports
2.5V_REF (out), ADC_VM (out), ISO_BIT_0 (out), ISO_BIT_1 (out), ISO_CTRL_EN (out), ISO_SPI_MISO0 (in), ISO_SPI_MOSI0 (out), ISO_SPI_SCK0 (out), JETSON_ISO_GND (out), JETSON_ISO_VDD (out), ~{ISO_CS}0 (out), ~{ISO_CS}1 (out), ~{ISO_CS}2 (out), ~{ISO_CS}3 (out), ~{ISO_CS}4 (out), ~{RST} (out)

### Nets
5V: C1.2(C2) J2.4 J2.5 R4.2(R2) R11.1(R1) TP5.1 U1.3(VIN)
GND: C1.1(C1) C2.1(C1) C3.1(C1) C4.1(C1) D2.2(K) D3.2(K) D4.2(K) J2.9 J2.10 R12.2(R2) SW1.1 SW1.2 TP4.1 U1.1(ADJ_/_GND)
PGND: C5.1(C1) D1.1(K) J2.6 J2.7 J2.8 R16.2(R2) TP2.1
VCC: D1.2(A) J2.1 J2.2 J2.3 R5.2(R2) R14.1(R1) TP3.1
VDD: C2.2(C2) R3.2(R2) R13.2(R2) TP1.1 U1.2(VOUT)
2.5V_REF: C3.2(C2) R11.2(R2) R12.1(R1) ; port 2.5V_REF
ADC_VM: C5.2(C2) R14.2(R2) R16.1(R1) ; port ADC_VM
CTRL_EN_M: J1.11 R?#11.2(R2)
~{ISO_CS}0: R?#2.1(R1) ; port ~{ISO_CS}0
~{ISO_CS}1: R?#3.1(R1) ; port ~{ISO_CS}1
~{ISO_CS}2: R?#4.1(R1) ; port ~{ISO_CS}2
~{ISO_CS}3: R?#5.1(R1) ; port ~{ISO_CS}3
~{ISO_CS}4: R?#6.1(R1) ; port ~{ISO_CS}4
ISO_BIT_0: R?#1.1(R1) ; port ISO_BIT_0
ISO_BIT_1: R?#7.1(R1) ; port ISO_BIT_1
ISO_CTRL_EN: R?#11.1(R1) ; port ISO_CTRL_EN
ISO_SPI_MISO0: R?#9.1(R1) ; port ISO_SPI_MISO0
ISO_SPI_MOSI0: R?#10.1(R1) ; port ISO_SPI_MOSI0
ISO_SPI_SCK0: R?#8.1(R1) ; port ISO_SPI_SCK0
JETSON_ISO_GND: J1.0(PAD) J1.13 ; port JETSON_ISO_GND
JETSON_ISO_VDD: J1.14 ; port JETSON_ISO_VDD
~{MSS}0: J1.2 R?#2.2(R2)
~{MSS}1: J1.3 R?#3.2(R2)
~{MSS}2: J1.4 R?#4.2(R2)
~{MSS}3: J1.5 R?#5.2(R2)
~{MSS}4: J1.6 R?#6.2(R2)
~{MSS}5: J1.7 R?#7.2(R2)
~{MSS}6: J1.1 R?#1.2(R2)
MCLK0: J1.8 R?#8.2(R2)
MISO0: J1.9 R?#9.2(R2)
MOSI0: J1.10 R?#10.2(R2)
~{RST}: C4.2(C2) J1.12 R13.1(R1) R15.1(R1) ; port ~{RST}
SW1: R15.2(R2) SW1.3 SW1.4
NetD2_1: D2.1(A) R3.1(R1)
NetD3_1: D3.1(A) R4.1(R1)
NetD4_1: D4.1(A) R5.1(R1)

Not connected (* = marked no-connect by the designer): J1 15; M1 1; M2 1; M3 1; M4 1

### Channels
Peripherals: designators C1=C1A C2=C2A C3=C3A C4=C1 C5=C16 D1=D1A D2=D2A#1 D3=D3A#1 D4=D4A#1 J1=J1A J2=J2A M1=M1A M2=M2A M3=M3A M4=M4A R3=R3A R4=R4A R5=R5A R11=R11A R12=R12A R13=R1 R14=R24 R15=R3 R16=R25 R?=R?A#1 R?=R?A#2 R?=R?A#3 R?=R?A#4 R?=R?A#5 R?=R?A#6 R?=R?A#7 R?=R?A#8 R?=R?A#9 R?=R?A#10 R?=R?A#11 SW1=SW1 TP1=TP1A TP2=TP2A TP3=TP3A TP4=TP4A TP5=TP5A U1=U1A; ports 2.5V_REF=2.5V_REF ADC_VM=ADC_VM ISO_BIT_0=IN1 ISO_BIT_1=IN1 ISO_CTRL_EN=ISO_CTRL_EN_Peripherals ISO_SPI_MISO0=ISO_SPI_MISO0 ISO_SPI_MOSI0=ISO_SPI_MOSI0 ISO_SPI_SCK0=ISO_SPI_SCK0 JETSON_ISO_GND=JETSON_ISO_GND JETSON_ISO_VDD=JETSON_ISO_VDD ~{ISO_CS}0=~{ISO_CS}0 ~{ISO_CS}1=~{ISO_CS}1 ~{ISO_CS}2=~{ISO_CS}2 ~{ISO_CS}3=~{ISO_CS}3 ~{ISO_CS}4=~{ISO_CS}4 ~{RST}=2.5V_REF
Peripherals: designators C1=C1B C2=C2B C3=C3B C4=C4B C5=C5B D1=D1B D2=D2B#2 D3=D3B#2 D4=D4B#2 J1=J1B J2=J2B M1=M1B M2=M2B M3=M3B M4=M4B R3=R3B R4=R4B R5=R5B R11=R11B R12=R12B R13=R13B R14=R14B R15=R15B R16=R16B R?=R?B#1 R?=R?B#2 R?=R?B#3 R?=R?B#4 R?=R?B#5 R?=R?B#6 R?=R?B#7 R?=R?B#8 R?=R?B#9 R?=R?B#10 R?=R?B#11 SW1=SW1B TP1=TP1B TP2=TP2B TP3=TP3B TP4=TP4B TP5=TP5B U1=U1B; ports 2.5V_REF=2.5V_REF ADC_VM=ADC_VM ISO_BIT_0=ISO_BIT_0_Peripherals ISO_BIT_1=ISO_BIT_1_Peripherals ISO_CTRL_EN=ISO_CTRL_EN_Peripherals ISO_SPI_MISO0=ISO_SPI_MISO0_Peripherals ISO_SPI_MOSI0=ISO_SPI_MOSI0_Peripherals ISO_SPI_SCK0=ISO_SPI_SCK0_Peripherals JETSON_ISO_GND=ISO_GND JETSON_ISO_VDD=ISO_VDD ~{ISO_CS}0=~{ISO_CS}0_Peripherals ~{ISO_CS}1=~{ISO_CS}1_Peripherals ~{ISO_CS}2=~{ISO_CS}2_Peripherals ~{ISO_CS}3=~{ISO_CS}3_Peripherals ~{ISO_CS}4=~{ISO_CS}4_Peripherals ~{RST}=~{RST}

### Notes on the sheet
- Power LEDs
- Vf = 2V
- 3.3V Fixed LDO
- 3V3/1A
- 24V
- ~10mA to 15mA through each line
- ****************************************
  3.3V LDO
  ****************************************
  Simple 3.3V fixed LDO
  Specifications
  ---------------------------
  - Vin = 1.35V - 18.0V
  - Vout = 3.3V
  - Iout = 1.0A
  - Pout = 3.3W
- Jetson Connections
- VDD is 3.3V (MCU digital power supply). VDD = digital , VDDA = analog
- (near R?#8) Pin 13
- (near R?#8) Pin 37
- (near R?#8) Pin 22
- IO on Jetson
- (near SW1) RESET
- TITLE
- SCALE:
- A3
- SIZE
- FILE NAME
- SHEET
- OF
- REV

### Library data of the parts
C1 C2 = CAP 10uF 35V_1: Default Symbol for Capacitors; Manufacturer Part Number 1: C2012X5R1V106K125AC; Tolerance: 10%; Temperature Coefficient: X5R; Part Number: CAP 10uF 35V_1; Supplier 1: Digi-Key; Supplier Part Number 1: 445-14418-1-ND
C3 C5 = CAP 100nF 50V: Default Symbol for Capacitors; Manufacturer Part Number 1: CC0603KPX7R9BB104; Value: 100nF; Tolerance: 10%; Rating: 50V; Temperature Coefficient: X7R; Part Number: CAP 100nF 50V; Supplier 1: Digi-Key; Supplier Part Number 1: 311-3567-1-ND; Manufacturer Part Number 2: 0805J0500104KJT; Supplier 2: Digi-Key; Supplier Part Number 2: 1608-1458-1-ND
C4 = CAP 3300pF 16V: Default Symbol for Capacitors; Manufacturer Part Number 1: C0603C332K4RACAUTO; Tolerance: 10%; Temperature Coefficient: X5R; Part Number: CAP 3300pF 16V; Supplier 1: Digi-Key; Supplier Part Number 1: 399-6881-1-ND; Manufacturer Part Number 2: C0805C332K4RAC7800; Supplier 2: Digi-Key; Supplier Part Number 2: 399-14593-1-ND
D1 = DIODE TVS 26VWM 53.5VC SMA: TVS DIODE 26V 53.5V SMA; Manufacturer Part Number: SMAJ26CA-TR; Power: 400W; Voltage Rating - DC: 26VWM, 53.5VC; Current Rating: 43A; Supplier 1: Digi-Key; Supplier Part Number 1: 497-12523-1-ND; Part Number: DIODE TVS 26VWM 53.5VC SMA; Supplier URL 1: https://www.digikey.ca/en/products/detail/stmicroelectronics/SMAJ26CA-TR/2214530?s=N4IgTCBcDaICwE4DsBaAjGArGAzOlAcgCIgC6AvkA; Pin Count: 2
D2-D4 = LED GREEN SMD: Typical RED, GREEN, YELLOW, AMBER GaAs LED; Voltage - Forward (Vf) (Typ): 2V; Lens Transparency: Clear; Current - Test: 20mA; Package: 1206; Color: Green
J1 = CN 15POS JST ZE SMT: CONN HEADER VERT SMD 15POS ZE; Supplier 1: Digi-Key; Supplier Part Number 1: 455-4211-1-ND; Part Number: CN 15POS JST ZE SMT; Manufacturer Part Number: BM15B-ZESS-TBT(LF)(SN); Supplier URL 1: https://www.digikey.ca/en/products/detail/jst-sales-america-inc/BM15B-ZESS-TBT-LF-SN/1886999?s=N4IgTCBcDaIEIFkCMBWOBaAWgUQMq-QBU5CAKAGQDEBKU3AOWpAF0BfIA; Pin Count: 15
J2 = CN HDR 10POS MOLEX 0430451012: CONN HEADER VERT 10POS 3MM; Supplier 1: Digi-Key; Manufacturer Part Number: 0430451012; Supplier Part Number 1: 455-1696-1-ND; Part Number: CN HDR 10POS MOLEX 0430451012; Supplier URL 1: https://www.digikey.ca/en/products/detail/molex/0430451012/252506?s=N4IgTCBcDaIAwBYDMiCsBGO6IF0C%2BQA; Pin Count: 10
M1-M4 = MOUNTING HOLE: Mounting Hole, Plated, Through Hole, Via 5.557mm, Hole 3.618mm; Hole Size: 3.618mm; Via Size: 5.557mm
R3 = RES 110.0 1/8W - 1%: RES SMD 110 OHM 1% 1/8W 0805/0603; Power (Watts): 0.125W; Package: 0805; Value: 110; Tolerance: 1%
R4 = RES 330.0 1/8W - 5%: RES SMD 330 OHM 5% 1/8W 0805; Power (Watts): 0.125W; Package: 0805; Value: 330; Tolerance: 5%
R5 = RES 1.96k 1/8W: RES SMD 1.96K OHM 1% 1/8W 0805; Power (Watts): 0.125W; Package: 0805; Value: 1.96k; Tolerance: 1%
R11 R12 = RES 4.7k 1/8W - 1%: Default Resistor Symbol; Value: 1; Power (Watts): 0.125W; Tolerance: 5%; Package: 0805; Part Number: RES 4.7k 1/8W - 1%
R13 = RES 39k 1/8W: Default Resistor Symbol; Manufacturer Part Number 1: CRG0805F39K; Value: 39k; Power (Watts): 0.125W; Tolerance: 1%; Tolerance 2: 0.05%; Package: 0805; Part Number: RES 39k 1/8W; Supplier 1: Digi-Key; Supplier Part Number 1: A126366CT-ND; Manufacturer Part Number 2: ERA-3VRW3902V; Supplier 2: Digi-Key; Supplier Part Number 2: 10-ERA-3VRW3902VCT-ND
R14 = RES 47k 1/8W - 1%: Default Resistor Symbol; Manufacturer Part Number 1: MCT06030C4702FP500; Value: 47k; Power (Watts): 0.125W; Tolerance: 1%; Package: 0805; Part Number: RES 47k 1/8W - 1%; Supplier 1: Digi-Key; Supplier Part Number 1: MCT0603-47.0K-CFCT-ND; Manufacturer Part Number 2: AC0805FR-0747KL; Supplier 2: Digi-Key; Supplier Part Number 2: YAG3735CT-ND; Tolerance 2: 1%
R15 R?#1-R?#11 = RES 100.0 1/8W - 5%: Default Resistor Symbol; Manufacturer Part Number 1: RMCF0805JT100R; Value: 100; Power (Watts): 0.125W; Tolerance: 5%; Package: 0805; Part Number: RES 100.0 1/8W - 5%; Supplier 1: Digi-Key; Supplier Part Number 1: RMCF0805JT100RCT-ND; Manufacturer Part Number 2: RK73B1JRTTD101J; Supplier 2: Digi-Key; Supplier Part Number 2: 2019-RK73B1JRTTD101JCT-ND; Tolerance 2: 5%
R16 = RES 1k 1/8W - 1%: Default Resistor Symbol; Manufacturer Part Number 1: MCT06030C1001FP500; Value: 1k; Power (Watts): 0.125W; Tolerance: 1%; Package: 0805; Part Number: RES 1k 1/8W - 1%; Supplier 1: Digi-Key; Supplier Part Number 1: MCT0603-1.00K-CFCT-ND; Manufacturer Part Number 2: RMCF0805FT1K00; Supplier 2: Digi-Key; Supplier Part Number 2: RMCF0805FT1K00CT-ND; Tolerance 2: 1%
SW1 = SW PUSH NO SMD: Switch Tactile N.O. SPST Round Button Gull Wing 0.05A 12VDC 2.55N SMD T/R; Manufacturer Part Number: TL3305BF260QG / TL3305BF260QG; Supplier 1: Digi-Key; Supplier Part Number 1: EG5354CT-ND; Part Number: SW PUSH NO SMD; Supplier URL 1: https://www.digikey.ca/en/products/detail/e-switch/TL3305BF260QG/5816185?s=N4IgTCBcDaIKIHECsBmJAWAwgFQLQDkAREAXQF8g
U1 = ZLDO1117K33TC: Linear Voltage Regulator IC Positive Fixed 1 Output  1A TO-252-3; MF: Diodes Incorporated; Package: TO-252-3; MP: ZLDO1117K33TC; Digikey: ZLDO1117K33DIDKR-ND; Digikey Link: https://www.digikey.ca/product-detail/en/diodes-incorporated/ZLDO1117K33TC/ZLDO1117K33DIDKR-ND/2095639; Supplier 1: Digi-Key; Supplier Part Number 1: ZLDO1117K33DICT-ND; Part Number: ZLDO1117K33TC; Manufacturer Part Number: ZLDO1117K33TC; Suppler URL 1: https://www.digikey.ca/product-detail/en/diodes-incorporated/ZLDO1117K33TC/ZLDO1117K33DIDKR-ND/2095639
TP1-TP5 = Test Point (Via): Part Number: Test Point (Via)

## Sheet motordriver-v5.0_inductors.SchDoc
size A4; SheetNumber: 7; SheetTotal: 10
Used 2 times, as channels INDUCTORS, INDUCTORS. Parts and nets are listed once, with the designators drawn on the sheet.
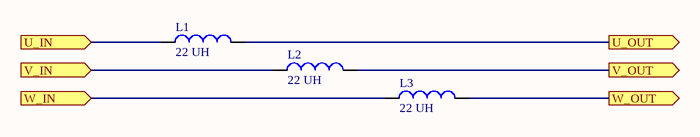
[diagram p3: motordriver-v5.0_inductors.SchDoc]

### Parts
L1  22 UH  [EATON _HCM1A1307V2-220-R]
L2  22 UH  [EATON _HCM1A1307V2-220-R]
L3  22 UH  [EATON _HCM1A1307V2-220-R]

### Ports
U_IN (in), U_OUT (out), V_IN (in), V_OUT (out), W_IN (in), W_OUT (out)

### Nets
U_IN: L1.1 ; port U_IN
U_OUT: L1.2 ; port U_OUT
V_IN: L2.1 ; port V_IN
V_OUT: L2.2 ; port V_OUT
W_IN: L3.1 ; port W_IN
W_OUT: L3.2 ; port W_OUT

### Channels
INDUCTORS: designators end in A; ports U_IN=U4_IN U_OUT=U4_OUT V_IN=V4_IN V_OUT=V4_OUT W_IN=W4_IN W_OUT=W4_OUT
INDUCTORS: designators end in B; ports U_IN=U_IN_INDUCTORS U_OUT=U_OUT_INDUCTORS V_IN=V_IN_INDUCTORS V_OUT=V_OUT_INDUCTORS W_IN=W_IN_INDUCTORS W_OUT=W_OUT_INDUCTORS

### Library data of the parts
L1-L3 = IND 22UH 6A 33.1 mOHM SMD: Automotive Grade High Current Power Inductor 22uH 6A 28.8mOhm 5MHz SRF 2-Pin Surface Mount T/R; Manufacturer Part Number: HCM1A1307V2-220-R; Supplier 1: Digi-Key; Supplier Part Number 1: 283-HCM1A1307V2-220-RCT-ND; Part Number: IND 22UH 6A 33.1 mOHM SMD; Supplier URL 1: https://www.digikey.ca/en/products/detail/eaton-electronics-division/HCM1A1307V2-220-R/10479205?s=N4IgTCBcDa4BwGYC0AJAwgWQIwEEsIAYB2ANTCTDAKQCU0AVJAOQBEQBdAXyA; Value: 22 uH

## Sheet motordriver-v5.0_trinamic-controller-dribbler.SchDoc
size B; SheetNumber: 5; SheetTotal: 13
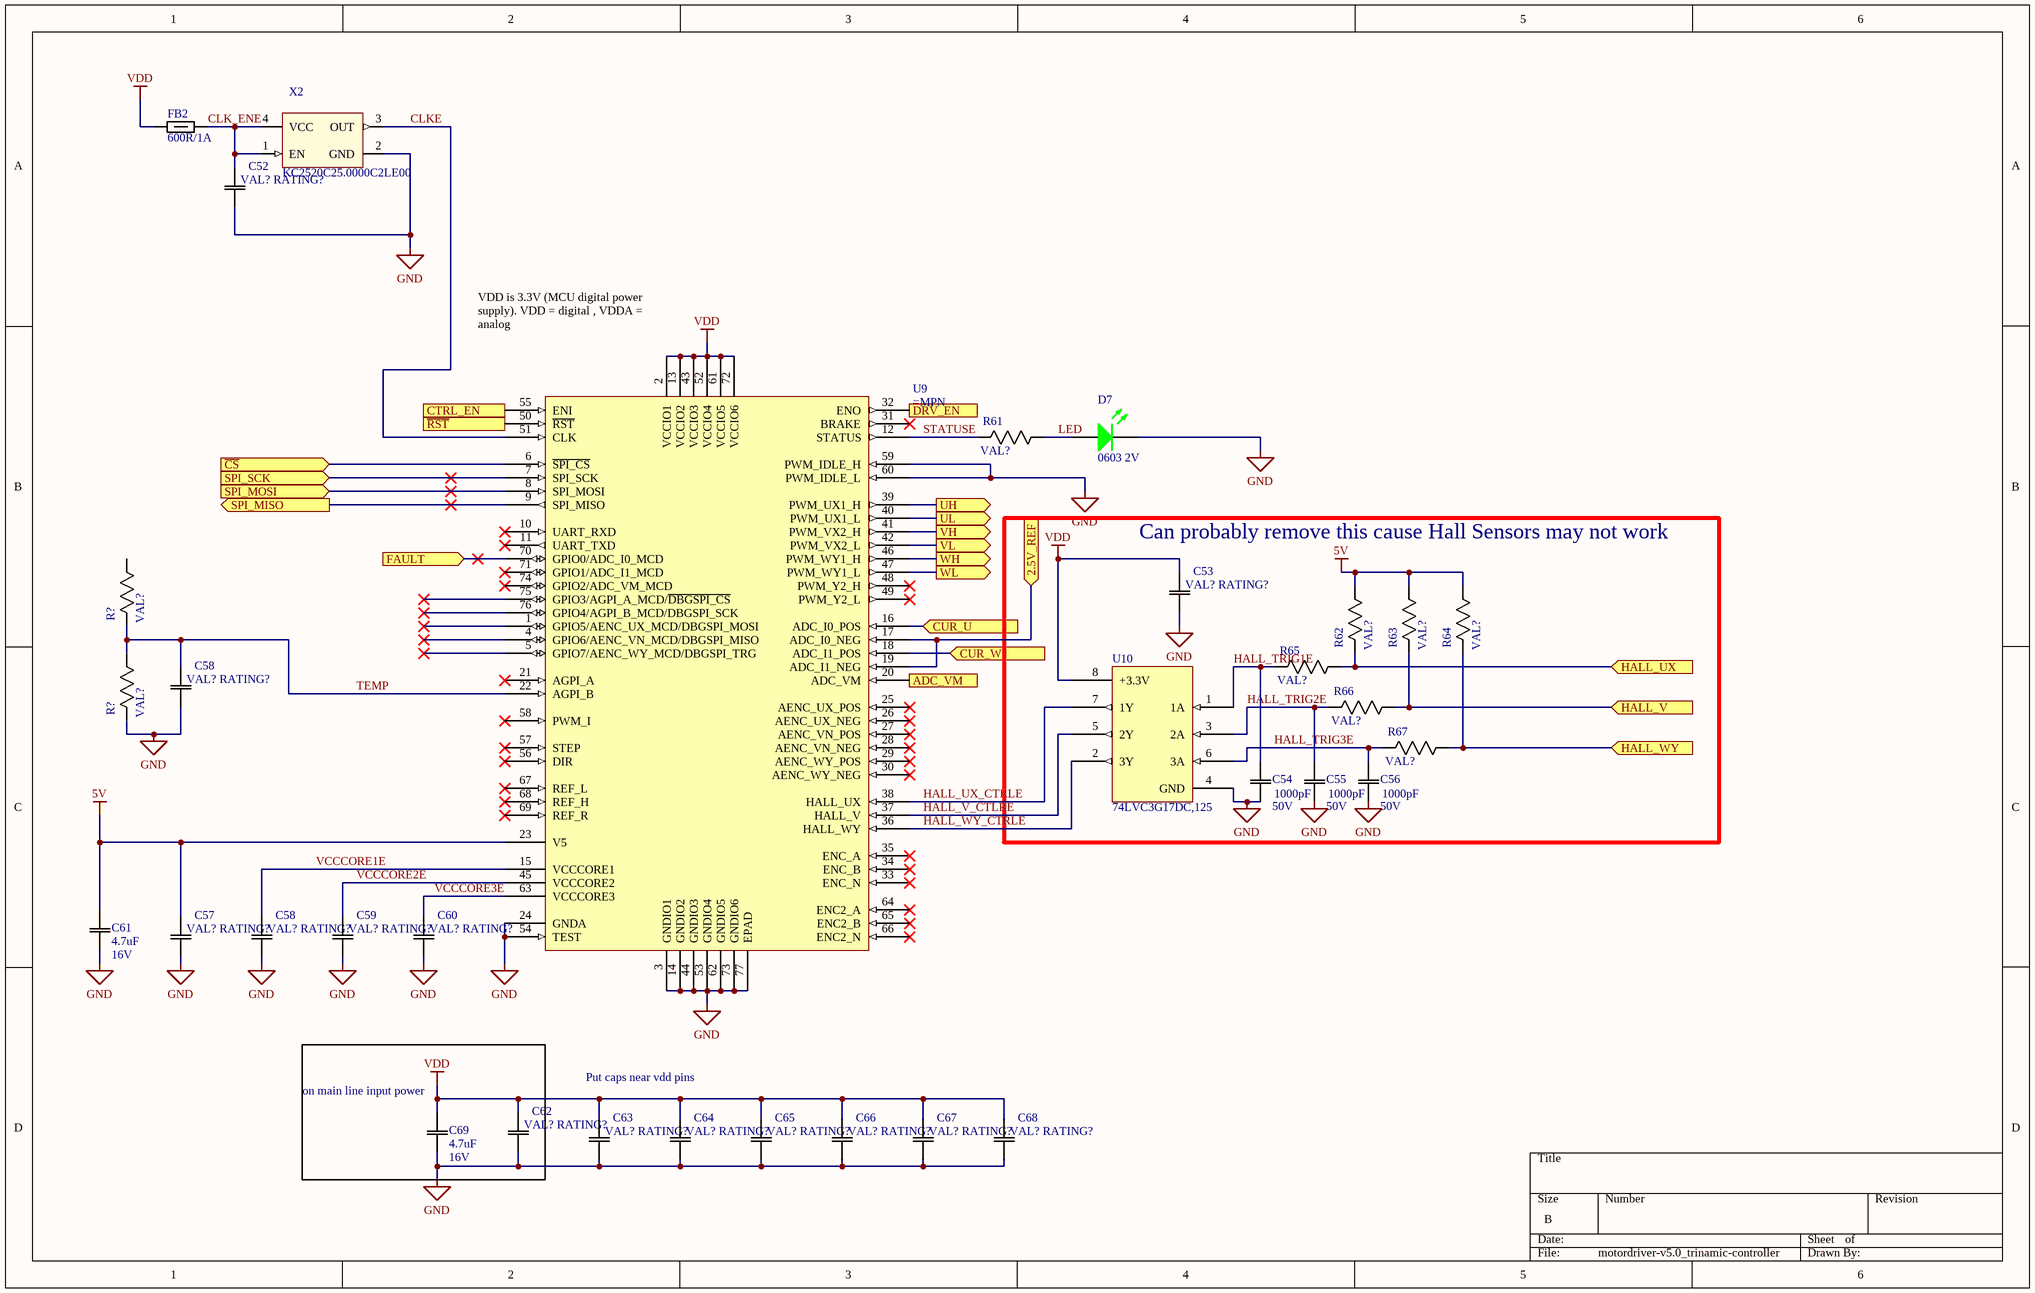
[diagram p4: motordriver-v5.0_trinamic-controller-dribbler.SchDoc]

### Parts
(Parts that share a designator on the sheet are numbered #1, #2 ... from top to bottom, then left to right.)
C52  VAL? RATING?  [0603]
C53  VAL? RATING?  [0603]
C54  value 1000pF  Rating: 50V  [0603]  (hidden comment: VAL? RATING?)
C55  value 1000pF  Rating: 50V  [0603]  (hidden comment: VAL? RATING?)
C56  value 1000pF  Rating: 50V  [0603]  (hidden comment: VAL? RATING?)
C57  VAL? RATING?  [0603]
C58#1  VAL? RATING?  [0603]
C58#2  VAL? RATING?  [0603]
C59  VAL? RATING?  [0603]
C60  VAL? RATING?  [0603]
C61  value 4.7uF  Rating: 16V  [0603]  (hidden comment: VAL? RATING?)
C62  VAL? RATING?  [0603]
C63  VAL? RATING?  [0603]
C64  VAL? RATING?  [0603]
C65  VAL? RATING?  [0603]
C66  VAL? RATING?  [0603]
C67  VAL? RATING?  [0603]
C68  VAL? RATING?  [0603]
C69  value 4.7uF  Rating: 16V  [0603]  (hidden comment: VAL? RATING?)
D7  0603 2V  [0603 - LED]
FB2  600R/1A  [0603]
R61  VAL?  [0603]
R62  VAL?  [0603]
R63  VAL?  [0603]
R64  VAL?  [0603]
R65  VAL?  [0603]
R66  VAL?  [0603]
R67  VAL?  [0603]
R?#1  VAL?  [0603]
R?#2  VAL?  [0603]
U9  (no value)  [QFN40P1050X650X90_HS-77N]
U10  74LVC3G17DC,125  [8-VSSOP]
X2  KC2520C25.0000C2LE00  [KC2520C25.0000C2LE00]

### Blocks framed on the sheet
Can probably remove this cause Hall Sensors may not work: C53-C56 R62-R67 U10
on main line input power: C62 C69

### Ports
2.5V_REF (in), ADC_VM (in), CTRL_EN (in), CUR_U (in), CUR_W (in), DRV_EN (out), FAULT (in), HALL_UX (in), HALL_V (in), HALL_WY (in), SPI_MISO (out), SPI_MOSI (in), SPI_SCK (in), UH (out), UL (out), VH (out), VL (out), WH (out), WL (out), ~{CS} (in), ~{RST} (in)

### Nets
5V: C57.2(C2) C61.2(C2) R62.1(R1) R63.1(R1) R64.1(R1) U9.23(V5)
GND: C52.1(C1) C53.1(C1) C54.1(C1) C55.1(C1) C56.1(C1) C57.1(C1) C58#1.1(C1) C58#2.1(C1) C59.1(C1) C60.1(C1) C61.1(C1) C62.1(C1) C63.1(C1) C64.1(C1) C65.1(C1) C66.1(C1) C67.1(C1) C68.1(C1) C69.1(C1) D7.2(K) R?#2.2(R2) U9.3(GNDIO1) U9.14(GNDIO2) U9.24(GNDA) U9.44(GNDIO3) U9.53(GNDIO4) U9.54(TEST) U9.59(PWM_IDLE_H) U9.60(PWM_IDLE_L) U9.62(GNDIO5) U9.73(GNDIO6) U9.77(EPAD) U10.4(GND) X2.2(GND)
VDD: C53.2(C2) C62.2(C2) C63.2(C2) C64.2(C2) C65.2(C2) C66.2(C2) C67.2(C2) C68.2(C2) C69.2(C2) FB2.1 U9.2(VCCIO1) U9.13(VCCIO2) U9.43(VCCIO3) U9.52(VCCIO4) U9.61(VCCIO5) U9.72(VCCIO6) U10.8(+3.3V)
2.5V_REF: U9.17(ADC_I0_NEG) U9.19(ADC_I1_NEG) U9.50(~{RST}) ; port 2.5V_REF, port ~{RST}
ADC_VM: U9.20(ADC_VM) ; port ADC_VM
~{CS}4: U9.6(~{SPI_CS}) ; port ~{CS}
CLK_ENE: C52.2(C2) FB2.2 X2.1(EN) X2.4(VCC)
CLKE: U9.51(CLK) X2.3(OUT)
CTRL_EN: U9.55(ENI) ; port CTRL_EN
CUR_U4: U9.16(ADC_I0_POS) ; port CUR_U
CUR_W4: U9.18(ADC_I1_POS) ; port CUR_W
DRV_EN_4: U9.32(ENO) ; port DRV_EN
FAULT4: U9.70(GPIO0/ADC_I0_MCD) ; port FAULT
HALL_TRIG1E: C54.2(C2) R65.2(R2) U10.1(1A)
HALL_TRIG2E: C55.2(C2) R66.2(R2) U10.3(2A)
HALL_TRIG3E: C56.2(C2) R67.2(R2) U10.6(3A)
HALL_UX4: R62.2(R2) R65.1(R1) ; port HALL_UX
HALL_UX_CTRLE: U9.38(HALL_UX) U10.7(1Y)
HALL_V4: R63.2(R2) R66.1(R1) ; port HALL_V
HALL_V_CTLRE: U9.37(HALL_V) U10.5(2Y)
HALL_WY4: R64.2(R2) R67.1(R1) ; port HALL_WY
HALL_WY_CTRLE: U9.36(HALL_WY) U10.2(3Y)
LED: D7.1(A) R61.1(R1)
SPI_MISO0: U9.7(SPI_SCK) ; port SPI_SCK
SPI_MOSI0: U9.8(SPI_MOSI) ; port SPI_MOSI
SPI_SCK0: U9.9(SPI_MISO) ; port SPI_MISO
STATUSE: R61.2(R2) U9.12(STATUS)
TEMP: C58#1.2(C2) R?#1.2(R2) R?#2.1(R1) U9.22(AGPI_B)
UH4: U9.39(PWM_UX1_H) ; port UH
UL4: U9.40(PWM_UX1_L) ; port UL
VCCCORE1E: C58#2.2(C2) U9.15(VCCCORE1)
VCCCORE2E: C59.2(C2) U9.45(VCCCORE2)
VCCCORE3E: C60.2(C2) U9.63(VCCCORE3)
VH4: U9.41(PWM_VX2_H) ; port VH
VL4: U9.42(PWM_VX2_L) ; port VL
WH4: U9.46(PWM_WY1_H) ; port WH
WL4: U9.47(PWM_WY1_L) ; port WL

Not connected (* = marked no-connect by the designer): R?#1 1(R1); U9 1(GPIO5/AENC_UX_MCD/DBGSPI_MOSI)* 4(GPIO6/AENC_VN_MCD/DBGSPI_MISO)* 5(GPIO7/AENC_WY_MCD/DBGSPI_TRG)* 10(UART_RXD)* 11(UART_TXD)* 21(AGPI_A)* 25(AENC_UX_POS)* 26(AENC_UX_NEG)* 27(AENC_VN_POS)* 28(AENC_VN_NEG)* 29(AENC_WY_POS)* 30(AENC_WY_NEG)* 31(BRAKE)* 33(ENC_N)* 34(ENC_B)* 35(ENC_A)* 48(PWM_Y2_H)* 49(PWM_Y2_L)* 56(DIR)* 57(STEP)* 58(PWM_I)* 64(ENC2_A)* 65(ENC2_B)* 66(ENC2_N)* 67(REF_L)* 68(REF_H)* 69(REF_R)* 71(GPIO1/ADC_I1_MCD)* 74(GPIO2/ADC_VM_MCD)* 75(GPIO3/AGPI_A_MCD/~{DBGSPI_CS})* 76(GPIO4/AGPI_B_MCD/DBGSPI_SCK)*

### Notes on the sheet
- (near U9) VDD is 3.3V (MCU digital power supply). VDD = digital , VDDA = analog
- Put caps near vdd pins

### Library data of the parts
C52 C53 C57 C58#1 C58#2 C59 C60 C63-C68 = CAP 100nF 50V: as C3 on sheet motordriver-v5.0_peripherals; Part Number: CAP 100nF 50V; Supplier 1: Digi-Key; Supplier Part Number 1: 311-3567-1-ND; Manufacturer Part Number 2: 0805J0500104KJT; Supplier 2: Digi-Key; Supplier Part Number 2: 1608-1458-1-ND
C54-C56 = CAP 1000pF 50V: Default Symbol for Capacitors; Manufacturer Part Number 1: 06035C102K4Z2A / 06035C102K4Z2A; Tolerance: 10%; Temperature Coefficient: X7R; Part Number: CAP 1000pF 50V; Supplier 1: Digi-Key; Supplier Part Number 1: 478-6342-1-ND; Manufacturer Part Number 2: 08055C102KAT2A; Supplier 2: Digi-Key; Supplier Part Number 2: 478-1371-1-ND
C61 C69 = CAP 4.7uF 16V: Default Symbol for Capacitors; Manufacturer Part Number 1: C1608X5R1C475K080AE; Tolerance: 10%; Temperature Coefficient: X5R; Part Number: CAP 4.7uF 16V; Supplier 1: Digi-Key; Supplier Part Number 1: 445-175225-1-ND; Manufacturer Part Number 2: C2012X5R1C475K085AB; Supplier 2: Digi-Key; Supplier Part Number 2: 445-14382-1-ND
C62 = CAP 470nF 50V: Default Symbol for Capacitors; Manufacturer Part Number 1: C1608X7R1H474K080AC; Value: 470nF; Tolerance: 10%; Rating: 50V; Temperature Coefficient: X7R; Part Number: CAP 470nF 50V; Supplier 1: Digi-Key; Supplier Part Number 1: 445-5952-1-ND; Manufacturer Part Number 2: CL21B474KBFNNNG; Supplier 2: Digi-Key; Supplier Part Number 2: 1276-6482-1-ND
D7 = LED GREEN SMD 0603: LED Uni-Color Green 574nm 2-Pin Chip LED T/R; Manufacturer Part Number: LTST-C190KGKT; Current Rating: 20mA; Supplier 1: Digi-Key; Supplier Part Number 1: 160-1435-1-ND; Part Number: LED GREEN SMD 0603; Supplier URL 1: https://www.digikey.ca/en/products/detail/lite-on-inc/LTST-C190KGKT/386815?s=N4IgTCBcDaIIwDYAMBaOAWAzAVjSgcgCIgC6AvkA; Pin Count: 2; Voltage Rating - DC: 2V
FB2 = FERRITE BEAD 200 MOHM 0603 1LN: WURTH ELEKTRONIK - 742792651 - Ferrite Bead, 0603 [1608 Metric], 600 ohm, 1 A, WE-CBF Series, 0.2 ohm, &#177; 25%; Manufacturer Part Number: 742792651-220-R; Value: 600R/1A @ 100 MHz; Supplier 1: Digi-Key; Supplier Part Number 1: 732-1593-1-ND; Part Number: FERRITE BEAD 200 MOHM 0603 1LN; Supplier URL 1: https://www.digikey.ca/en/products/detail/w%C3%BCrth-elektronik/742792651/1638997?s=N4IgTCBcDaIOwGYwFoCMBWAnAtyByAIiALoC%2BQA
R61 = RES 75.0 1/8W - 5%: Default Resistor Symbol; Manufacturer Part Number 1: RMCF0805JT75R0; Value: 75; Power (Watts): 0.125W; Tolerance: 5%; Tolerance 2: 1%; Package: 0805; Part Number: RES 75.0 1/8W - 5%; Supplier 1: Digi-Key; Supplier Part Number 1: RMCF0805JT75R0CT-ND; Manufacturer Part Number 2: RNCP0603FTD75R0; Supplier 2: Digi-Key; Supplier Part Number 2: RNCP0603FTD75R0CT-ND
R62-R67 = RES 4.7k 1/8W - 5%: Default Resistor Symbol; Value: 1; Power (Watts): 0.125W; Tolerance: 5%; Package: 0805; Part Number: RES 4.7k 1/8W - 5%
R?#1 R?#2 = RES 4.7k 1/8W - 1%: as R11 on sheet motordriver-v5.0_peripherals; Package: 0805; Part Number: RES 4.7k 1/8W - 1%
U9 = TMC4671: Motor Driver, -40 To 125Deg C Rohs Compliant: Yes; Manufacturer Part Number: TMC4671-LA; Supplier 1: Digi-Key; Supplier Part Number 1: 1460-TMC4671-LA-ND; Part Number: TMC4671; Suppler URL 1: https://www.digikey.ca/en/products/detail/trinamic-motion-control-gmbh/TMC4671-LA/12174669?s=N4IgTCBcDaIIwBYBsAGAtAFQLIGFkHY40AZAQTQDkAREAXQF8g
U10 = IC 74LVC3G17DC,125: IC BUFFER TRIPLE SCHMITT TRIGGER 5.5V VSSOP-8; Manufacturer: Nexperia; Supplier 1: Newark; Manufacturer Part Number: 74LVC3G17DC,125; RoHS: Yes; Category: Logic Gates; Stock 1: 2995; Pricing 1: 1=0.84800, 5=0.83500, 10=0.70800, 25=0.62000, 50=0.53200, 100=0.44500, 250=0.41300, 500=0.38300, 1000=0.35200 (USD); RoHS Compliant: Yes; Supplier Part Number 1: 33AC1281
X2 = XTAL OSC 25MHz 3.3V: Oscillator XO 25MHz ±15ppm 15pF CMOS 55% 2.5V/3.3V 4-Pin Mini-CSMD T/R; Frequency: 32.768kHz; Load Capacitance: 12.5pF; Supplier 1: Digi-Key; Manufacturer Part Number: KC2520C25.0000C2LE00; Supplier Part Number 1: 1253-1254-6-ND; Part Number: XTAL OSC 25MHz 3.3V; Supplier URL 1: https://www.digikey.ca/en/products/detail/kyocera-avx/KC2520C25-0000C2LE00/4867084?s=N4IgTCBcDaIIxgKwGYC0DEBZUDZUDkAREAXQF8g

## Sheet motordriver-v5.0_connectors-dribbler.SchDoc
size A4; SheetNumber: 9; SheetTotal: 10
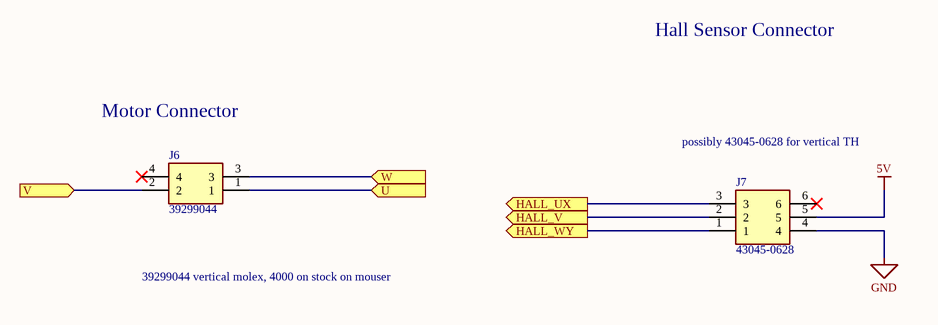
[diagram p5: motordriver-v5.0_connectors-dribbler.SchDoc]

### Parts
J6  39299044  [39299044]
J7  43045-0628  [430450628]

### Ports
HALL_UX (out), HALL_V (out), HALL_WY (out), U (in), V (in), W (in)

### Nets
5V: J7.5
GND: J7.4
HALL_UX4: J7.3 ; port HALL_UX
HALL_V4: J7.2 ; port HALL_V
HALL_WY4: J7.1 ; port HALL_WY
U4_OUT: J6.1 ; port U
V4_OUT: J6.2 ; port V
W4_OUT: J6.3 ; port W

Not connected (* = marked no-connect by the designer): J6 4*; J7 6*

### Notes on the sheet
- Hall Sensor Connector
- Motor Connector
- possibly 43045-0628 for vertical TH
- 39299044 vertical molex, 4000 on stock on mouser

### Library data of the parts
J6 = CN HDR 4POS Molex 39299044 VERT: Molex 39299044 4POS Minifit / dual row, vertical; Supplier 1: Digi-Key; Supplier Part Number 1: WM7336-ND; Part Number: CN HDR 4POS Molex 39299044 VERT; Manufacturer Part Number: 39299044; Supplier URL 1: https://www.digikey.ca/en/products/detail/molex/0039299044/1624292?s=N4IgTCBcDaIOoFkDsBmFA2AtAOQCIgF0BfIA; Pin Count: 4
J7 = CN HDR 6POS Molex 43045-0628: Molex 43045-0628 6POS Microfit / dual row, Vertical; Supplier 1: Digi-Key; Supplier Part Number 1: WM10679-ND; Part Number: CN HDR 6POS Molex 43045-0628; Manufacturer Part Number: 430450628; Supplier URL 1: https://www.digikey.ca/en/products/detail/molex/0430450628/3310200?s=N4IgTCBcDaICwGYAMcCsSBsYAcAdXIAugL5A; Pin Count: 6